# Altium project a311d.PrjPcb
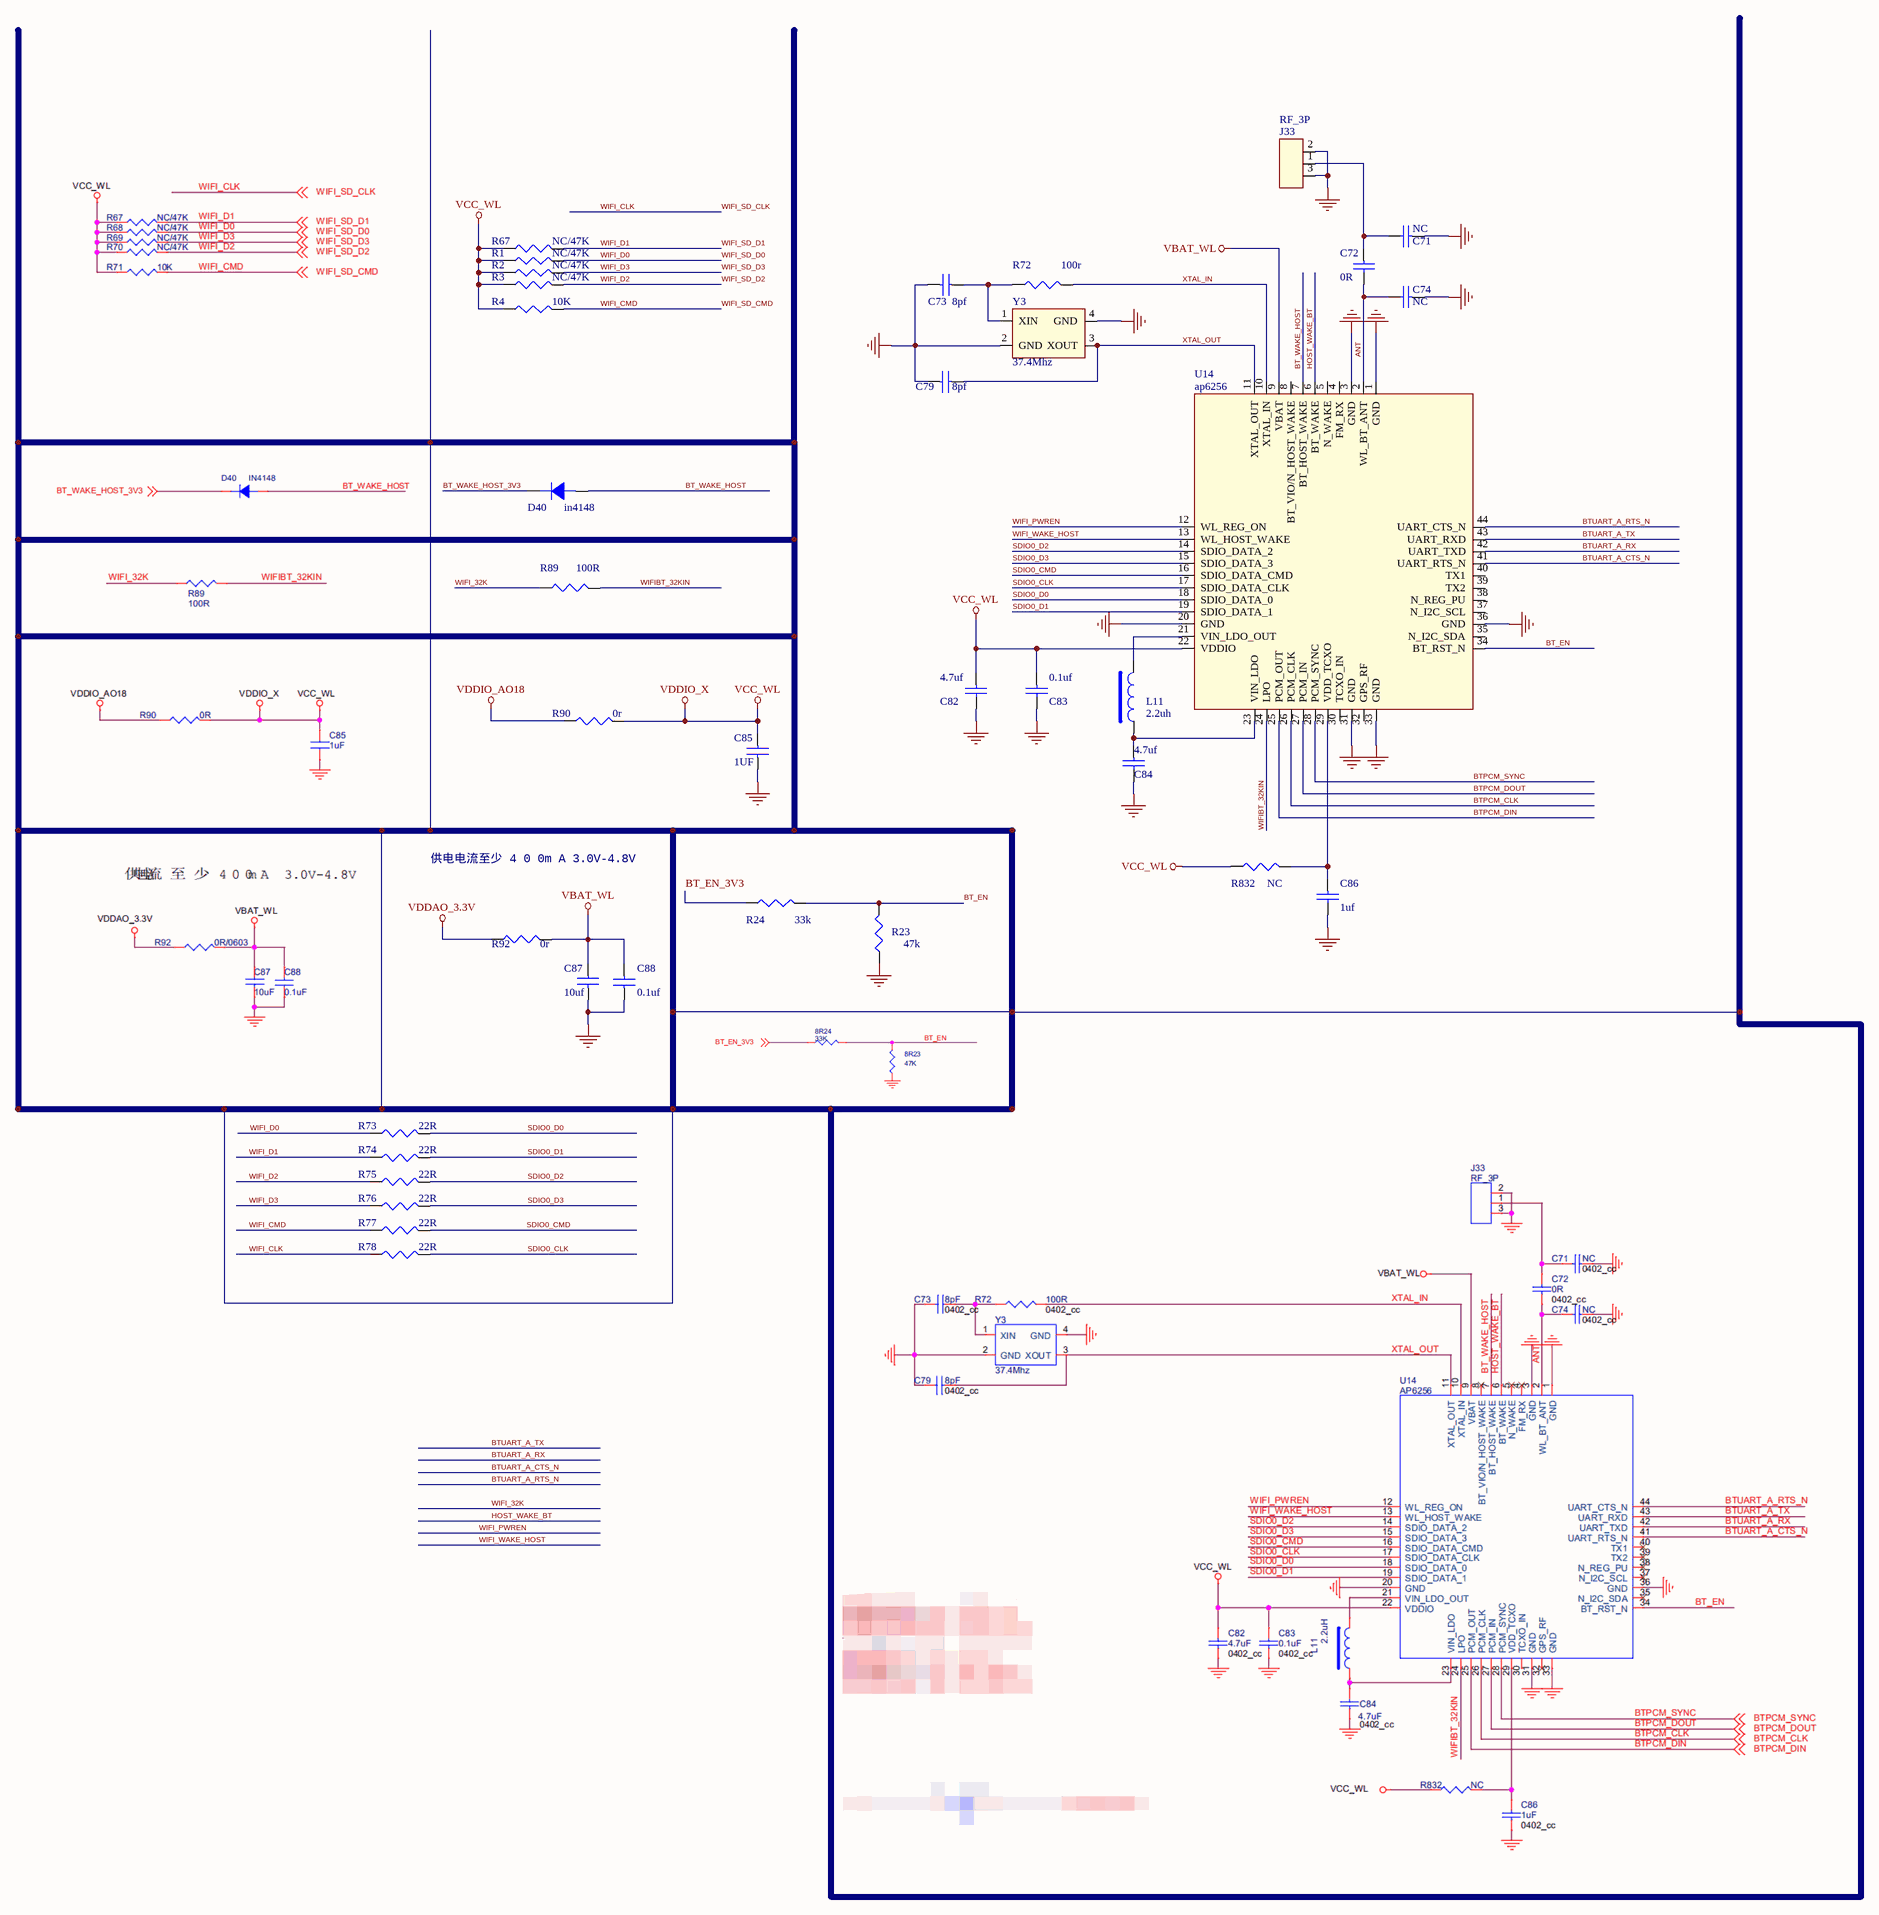
[diagram p0: wifi.SchDoc]
7 sheets, 219 parts. Net scope: global (net labels, ports and power ports of the same name join across sheets).
Board file: PCB2.PcbDoc
Sheets:
  wifi.SchDoc
  hdmi.SchDoc
  usb.SchDoc
  mipi_dsi.SchDoc
  tfcard.SchDoc
  SOC.SchDoc
  POWER.SchDoc

## Sheet wifi.SchDoc
size A2

### Parts
C71  NC
C72  0R
C73  8pf  [C0402]
C74  NC
C79  8pf  [C0402]
C82  4.7uf
C83  0.1uf
C84  4.7uf
C85  1UF  [C0402]
C86  1uf
C87  10uf  [C0402]
C88  0.1uf  [C0402]
D40  in4148
J33  RF_3P
L11  2.2uh
R1  NC/47K
R2  NC/47K
R3  NC/47K
R4  10K
R23  47k
R24  33k
R67  NC/47K
R72  100r  [R0402]
R73  22R
R74  22R
R75  22R
R76  22R
R77  22R
R78  22R
R89  100R
R90  0r
R92  0r
R832  NC
U14  ap6256
Y3  37.4Mhz  [CRY-3225]

### Nets
GND_IN: C71.2 C73.2 C74.2 C79.1 C82.1 C83.1 C84.1 C85.2 C86.1 C87.2 C88.1 J33.2 J33.3 R23.1 U14.1(GND) U14.3(GND) U14.20(GND) U14.31(GND) U14.33(GND) U14.36(GND) Y3.2(GND) Y3.4(GND)
VBAT_WL: C87.1 C88.2 R92.1 U14.9(VBAT)
VCC_WL: C82.2 C83.2 C85.1 R1.1 R2.1 R3.1 R4.1 R67.1 R90.1 R832.1 U14.22(VDDIO)  [also labelled VDDIO_X]
VDDAO_3.3V: R92.2
VDDIO_AO18: R90.2
ANT: C72.1 C74.1 U14.2(WL_BT_ANT)
BT_EN: R23.2 R24.2 U14.34(BT_RST_N)
BT_EN_3V3: R24.1
BT_WAKE_HOST: D40.1(A) U14.7(BT_HOST_WAKE)
BT_WAKE_HOST_3V3: D40.2(K)
BTPCM_CLK: U14.26(PCM_CLK)
BTPCM_DIN: U14.25(PCM_OUT)
BTPCM_DOUT: U14.27(PCM_IN)
BTPCM_SYNC: U14.28(PCM_SYNC)
BTUART_A_CTS_N: U14.41(UART_RTS_N)
BTUART_A_RTS_N: U14.44(UART_CTS_N)
BTUART_A_RX: U14.42(UART_TXD)
BTUART_A_TX: U14.43(UART_RXD)
HOST_WAKE_BT: U14.6(BT_WAKE)
SDIO0_CLK: R78.2 U14.17(SDIO_DATA_CLK)
SDIO0_CMD: R77.2 U14.16(SDIO_DATA_CMD)
SDIO0_D0: R73.2 U14.18(SDIO_DATA_0)
SDIO0_D1: R74.2 U14.19(SDIO_DATA_1)
SDIO0_D2: R75.2 U14.14(SDIO_DATA_2)
SDIO0_D3: R76.2 U14.15(SDIO_DATA_3)
WIFI_32K: R89.2
WIFI_CLK: R78.1  [also labelled WIFI_SD_CLK]
WIFI_CMD: R4.2 R77.1  [also labelled WIFI_SD_CMD]
WIFI_D0: R1.2 R73.1  [also labelled WIFI_SD_D0]
WIFI_D1: R67.2 R74.1  [also labelled WIFI_SD_D1]
WIFI_D2: R3.2 R75.1  [also labelled WIFI_SD_D2]
WIFI_D3: R2.2 R76.1  [also labelled WIFI_SD_D3]
WIFI_PWREN: U14.12(WL_REG_ON)
WIFI_WAKE_HOST: U14.13(WL_HOST_WAKE)
WIFIBT_32KIN: R89.1 U14.24(LPO)
XTAL_IN: R72.2 U14.10(XTAL_IN)
XTAL_OUT: C79.2 U14.11(XTAL_OUT) Y3.3(XOUT)
NetC71_1: C71.1 C72.2 J33.1
NetC73_1: C73.1 R72.1 Y3.1(XIN)
NetC84_2: C84.2 L11.1 U14.23(VIN_LDO)
NetC86_2: C86.2 R832.2 U14.29(VDD_TCXO)
NetL11_2: L11.2 U14.21(VIN_LDO_OUT)

Not connected (* = marked no-connect by the designer): U14 4(FM_RX) 5(N_WAKE) 8(BT_VIO/N_HOST_WAKE) 30(TCXO_IN) 32(GPS_RF) 35(N_I2C_SDA) 37(N_I2C_SCL) 38(N_REG_PU) 39(TX2) 40(TX1)

### Notes on the sheet
- 供电电流至少 4 0 0m A 3.0V-4.8V

### Library data of the parts
C71 C72 C74 C82-C84 C86 = CAPNP_Dup1_1
C73 C79 C85 C87 C88 = CAP NP
D40 = DIODE: J102: U4
J33 = CON3_1
L11 = INDUCTOR_1
R1-R4 R23 R24 R67 R73-R78 R89 R832 = RESISTOR
R72 = R_0
R90 R92 = RESISTOR_1
U14 = AP6493_1
Y3 = CRYSTAL-4_4: ass

## Sheet hdmi.SchDoc
size 720 x 297 mm
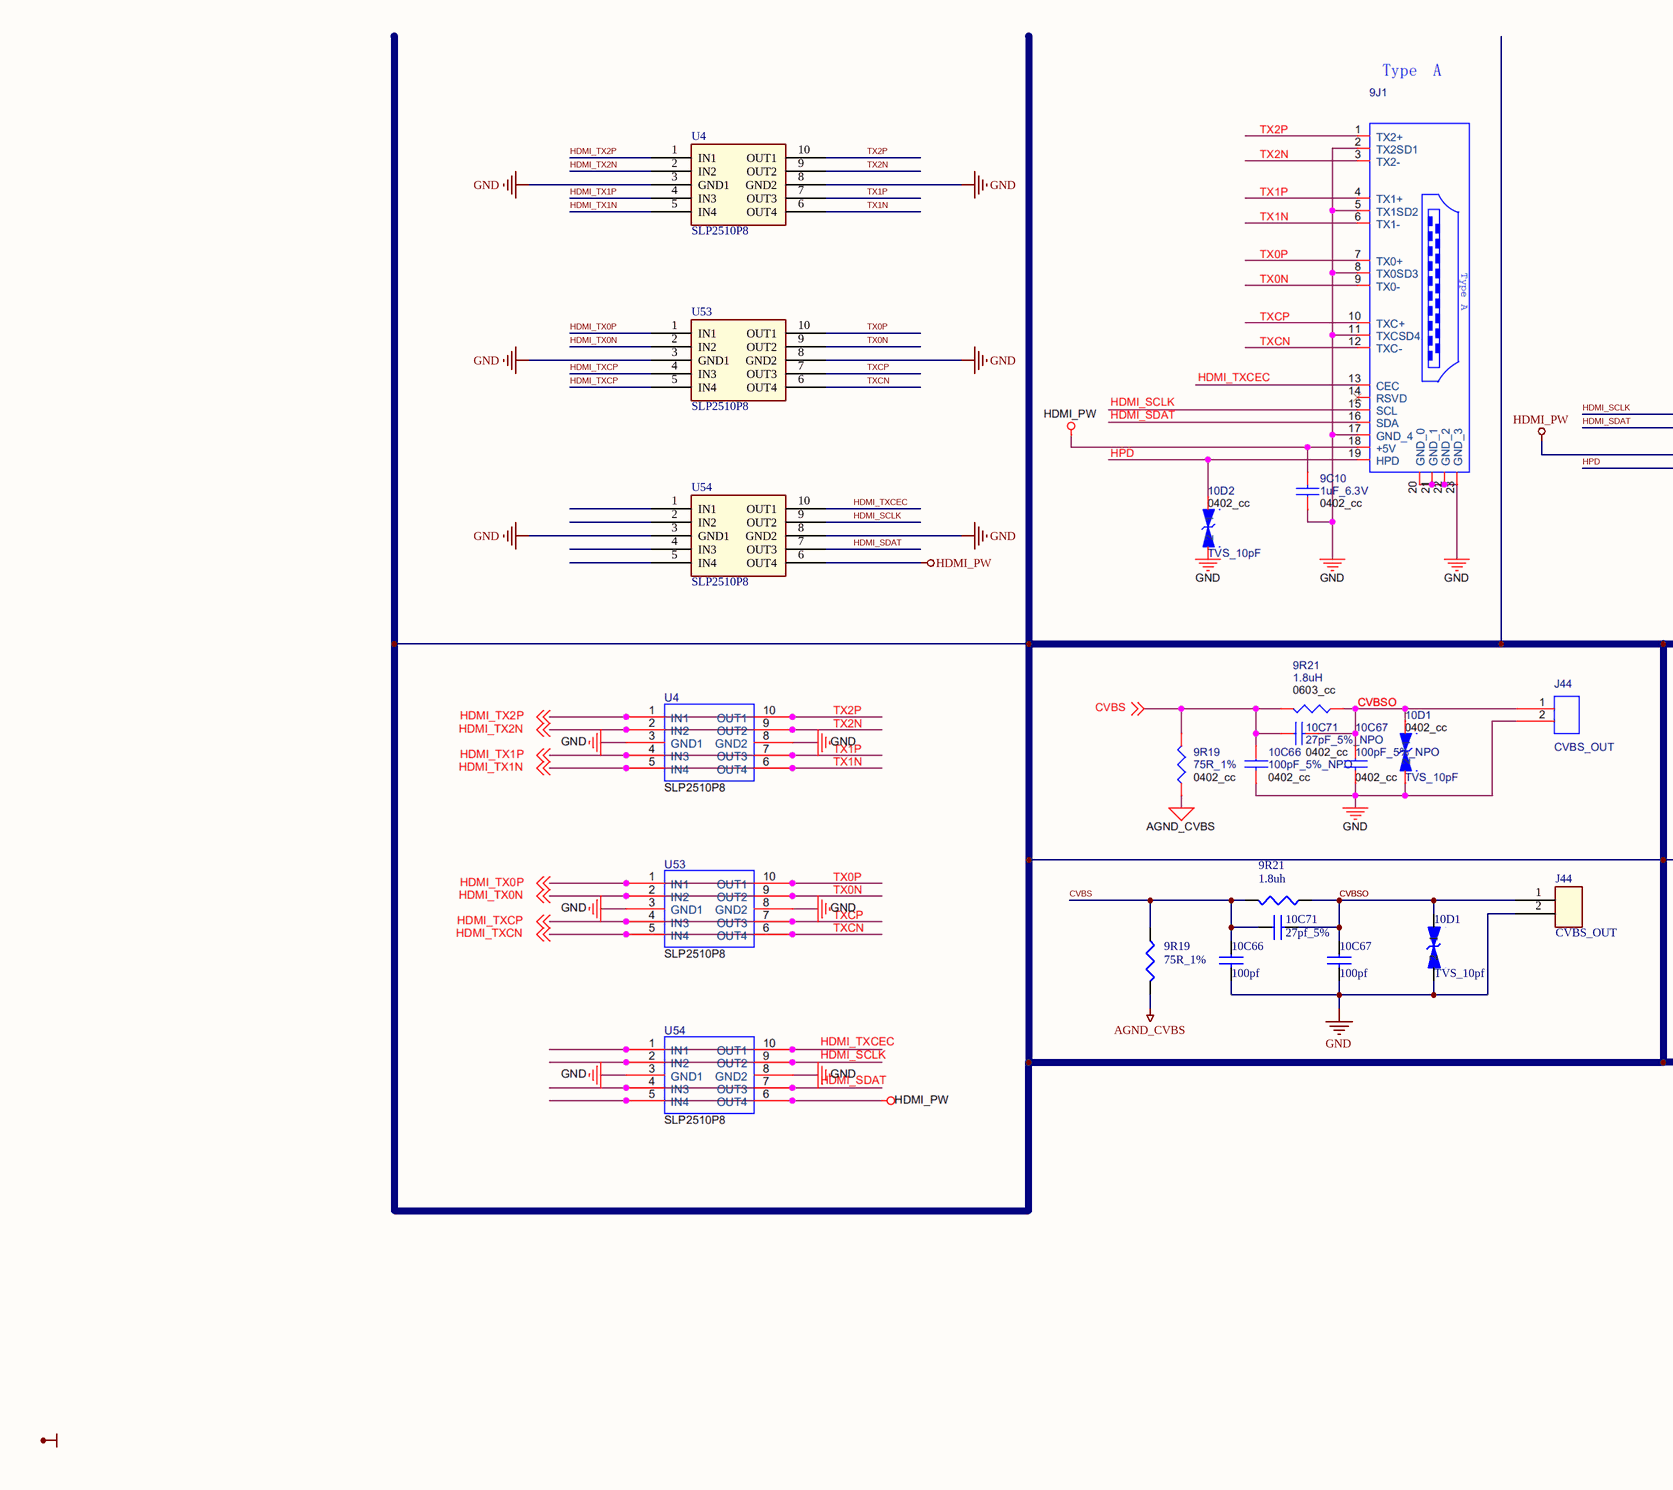
[diagram p1: hdmi.SchDoc, left]
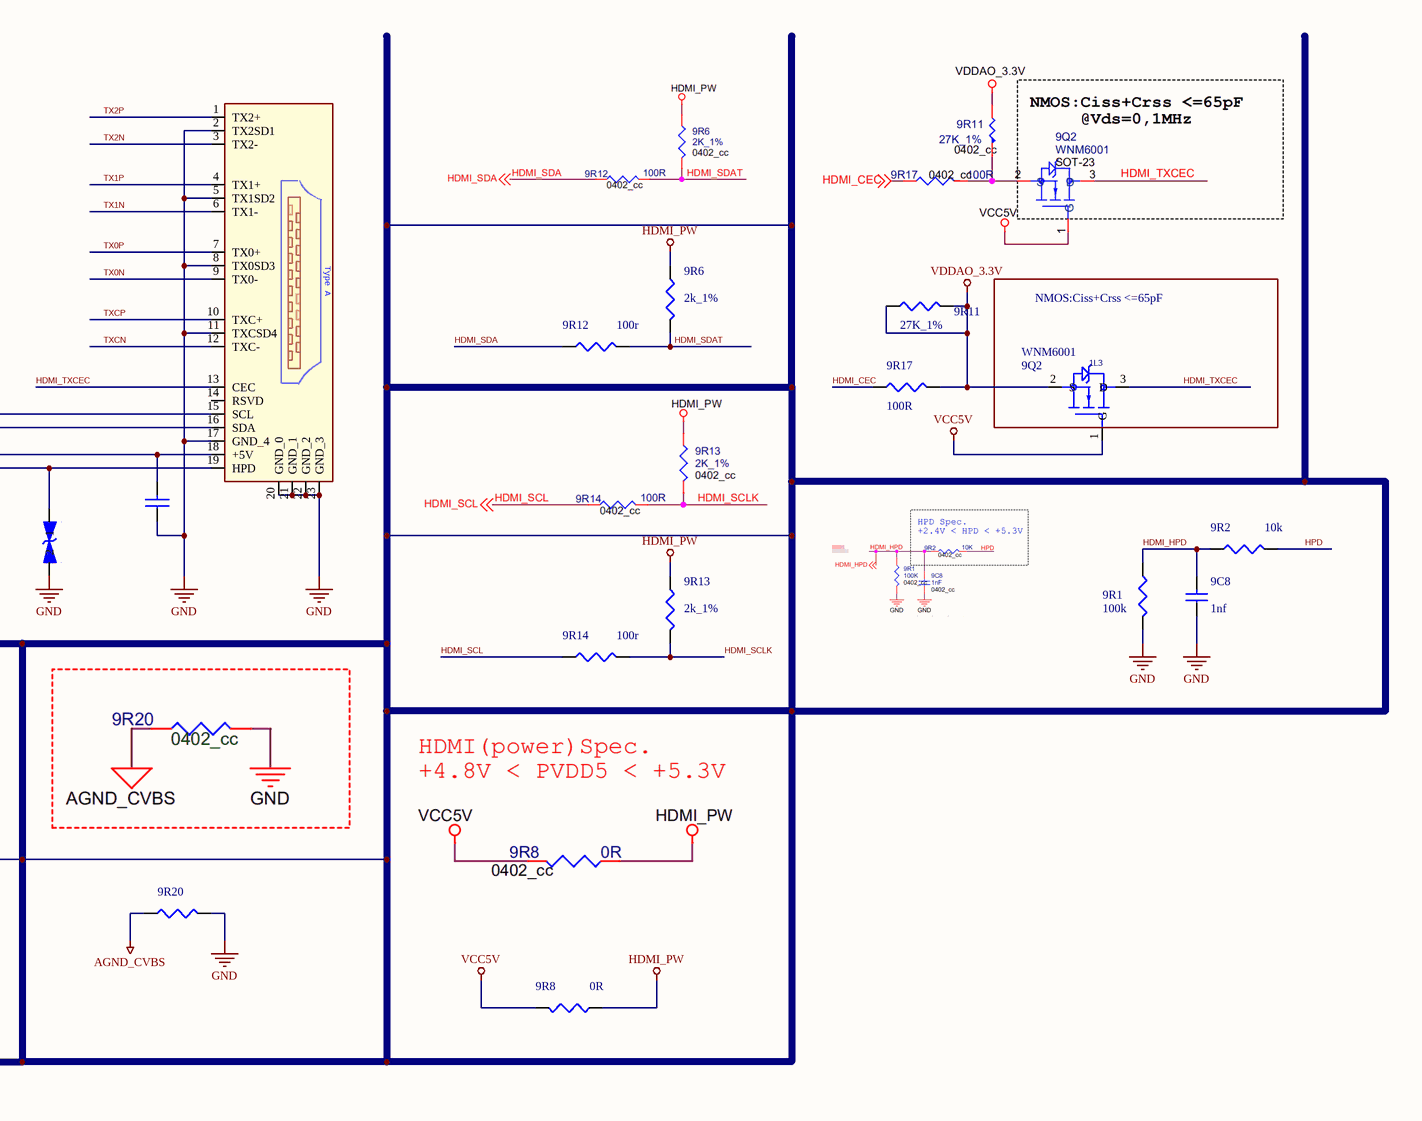
[diagram p2: hdmi.SchDoc, right]

### Parts
9C8  1nf  [0603C]
9C10  (no value)
9J1  (no value)
9Q2  WNM6001  J102: 1L3
9R1  100k
9R2  10k
9R6  2k_1%
9R8  0R
9R11  27K_1%
9R12  100r
9R13  2k_1%
9R14  100r
9R17  100R
9R19  75R_1%
9R20  (no value)
9R21  1.8uh
10C66  100pf
10C67  100pf
10C71  27pf_5%
10D1  TVS_10pf
10D2  (no value)
J44  CVBS_OUT
U4  SLP2510P8
U53  SLP2510P8
U54  SLP2510P8

### Blocks framed on the sheet
NMOS:Ciss+Crss <=65pF: 9Q2

### Nets
AGND_CVBS: 9R19.2 9R20.1
GND: 9C8.1 9C10.1 9J1.2(TX2SD1) 9J1.5(TX1SD2) 9J1.8(TX0SD3) 9J1.11(TXCSD4) 9J1.17(GND_4) 9J1.20(GND_0) 9J1.21(GND_1) 9J1.22(GND_2) 9J1.23(GND_3) 9R1.2 9R20.2 10C66.2 10C67.2 10D1.2 10D2.2 J44.2 U4.3(GND1) U4.8(GND2) U53.3(GND1) U53.8(GND2) U54.3(GND1) U54.8(GND2)
HDMI_PW: 9C10.2 9J1.18(+5V) 9R6.1 9R8.1 9R13.1 U54.6(OUT4)
VCC5V: 9Q2.1(G) 9R8.2
VDDAO_3.3V: 9Q2.2(S) 9R11.1 9R11.2 9R17.1
CVBS: 9R19.1 9R21.2 10C66.1 10C71.1
CVBSO: 9R21.1 10C67.1 10C71.2 10D1.1 J44.1
HDMI_CEC: 9R17.2
HDMI_HPD: 9C8.2 9R1.1 9R2.1
HDMI_SCL: 9R14.1
HDMI_SCLK: 9J1.15(SCL) 9R13.2 9R14.2 U54.9(OUT2)
HDMI_SDA: 9R12.1
HDMI_SDAT: 9J1.16(SDA) 9R6.2 9R12.2 U54.7(OUT3)
HDMI_TX0N: U53.2(IN2)
HDMI_TX0P: U53.1(IN1)
HDMI_TX1N: U4.5(IN4)
HDMI_TX1P: U4.4(IN3)
HDMI_TX2N: U4.2(IN2)
HDMI_TX2P: U4.1(IN1)
HDMI_TXCEC: 9J1.13(CEC) 9Q2.3(D) U54.10(OUT1)
HDMI_TXCP: U53.4(IN3) U53.5(IN4)
HPD: 9J1.19(HPD) 9R2.2 10D2.1
TX0N: 9J1.9(TX0-) U53.9(OUT2)
TX0P: 9J1.7(TX0+) U53.10(OUT1)
TX1N: 9J1.6(TX1-) U4.6(OUT4)
TX1P: 9J1.4(TX1+) U4.7(OUT3)
TX2N: 9J1.3(TX2-) U4.9(OUT2)
TX2P: 9J1.1(TX2+) U4.10(OUT1)
TXCN: 9J1.12(TXC-) U53.6(OUT4)
TXCP: 9J1.10(TXC+) U53.7(OUT3)

Not connected (* = marked no-connect by the designer): 9J1 14(RSVD); U54 1(IN1) 2(IN2) 4(IN3) 5(IN4)

### Notes on the sheet
- (in symbol J-HDMI-TYPE-A-19P_1) Type A

### Library data of the parts
9C8 = capnp
9C10 10C66 10C67 10C71 = CAP NP_6
9J1 = J-HDMI-TYPE-A-19P_1
9Q2 = Mosfetp_4: SOT-23; 1R42: Q1
9R1 9R2 9R6 9R8 9R12-9R14 9R20 = RESISTOR
9R11 9R17 = R
9R19 9R21 = RESISTOR_3
10D1 10D2 = TVS DIODE
J44 = CON2
U4 U53 U54 = rRClamp0524P

## Sheet usb.SchDoc
size A2
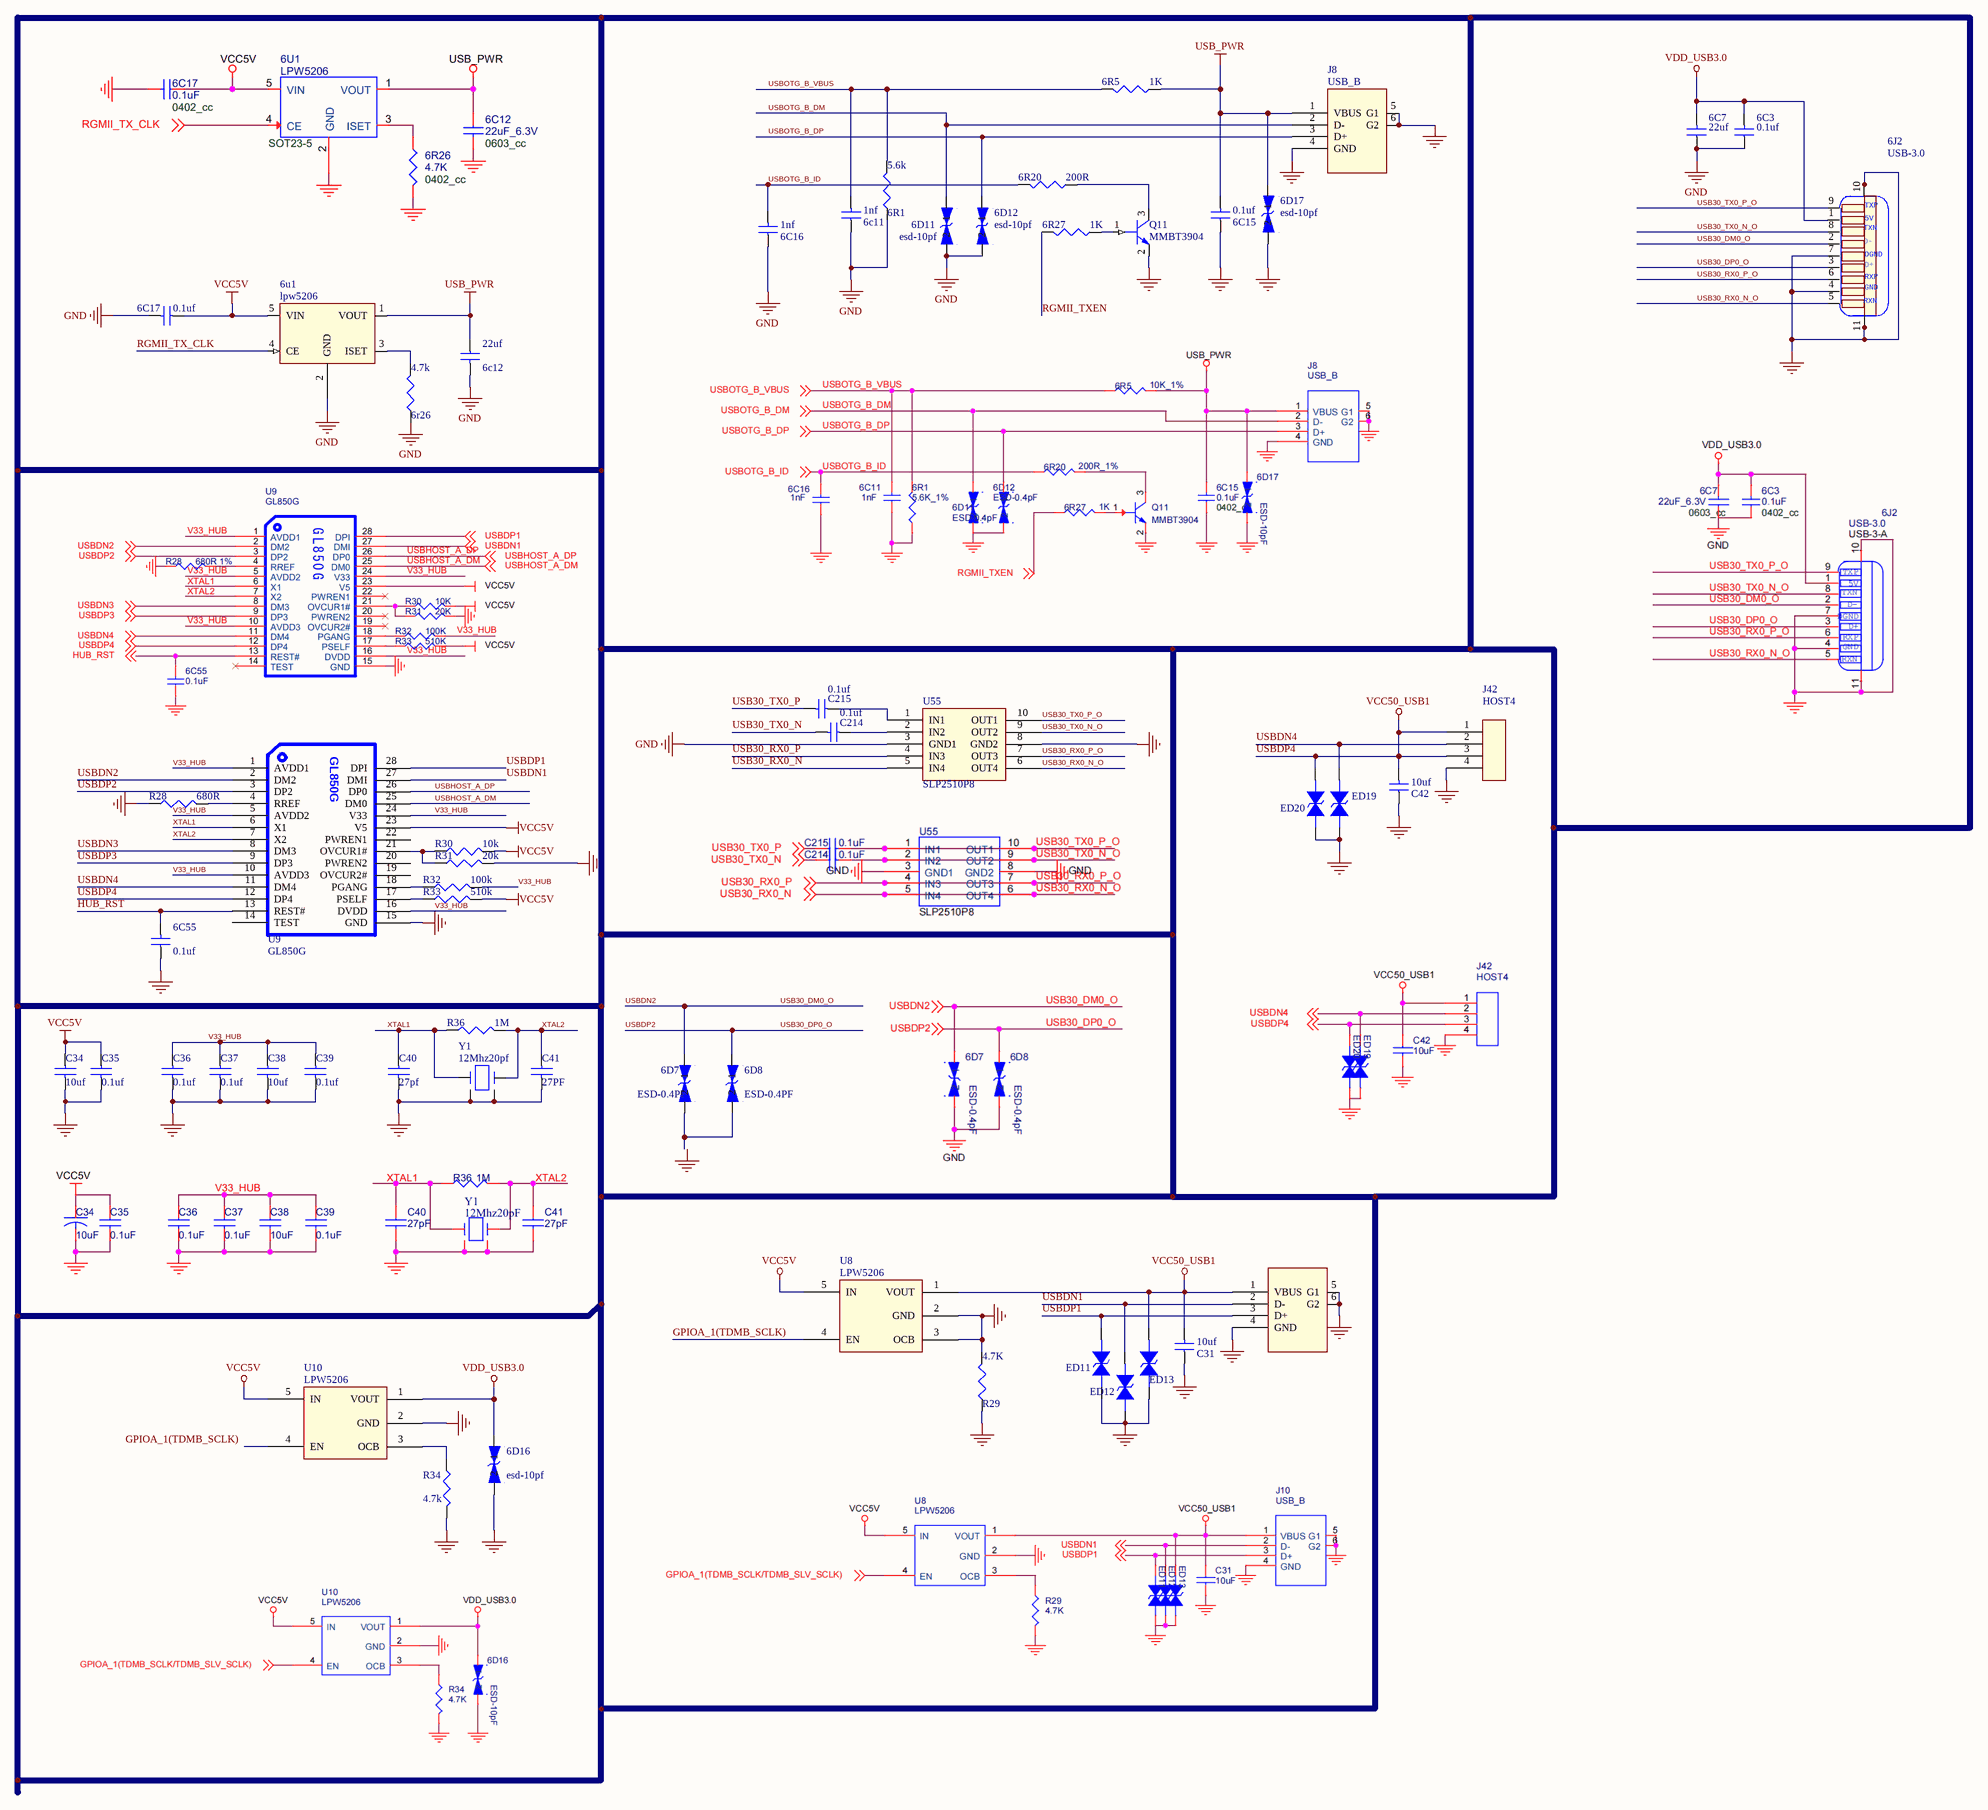
[diagram p3: usb.SchDoc]

### Parts
6C3  0.1uf  [0603C]
6C7  22uf  [0603C]
6c11  1nf  [0603C]
6c12  22uf  [0603C]
6C15  0.1uf  [0603C]
6C16  1nf  [0603C]
6C17  0.1uf  [0603C]
6C55  0.1uf  [0603C]
6D7  ESD-0.4PF
6D8  ESD-0.4PF
6D11  esd-10pf
6D12  esd-10pf
6D16  esd-10pf
6D17  esd-10pf
6J2  USB-3.0
6R1  5.6k  [R0603]
6R5  1K  [R0603]
6R20  200R  [R0603]
6r26  4.7k  [R0603]
6R27  1K  [R0603]
6u1  lpw5206  [SOT-25]
C31  10uf  [0603C]
C34  10uf
C35  0.1uf
C36  0.1uf
C37  0.1uf
C38  10uf
C39  0.1uf
C40  27pf
C41  27PF
C42  10uf  [0603C]
C214  0.1uf  [0603C]
C215  0.1uf  [0603C]
ED11  (no value)
ED12  (no value)
ED13  (no value)
ED19  (no value)
ED20  (no value)
J4  (no value)
J8  USB_B
J42  HOST4
Q11  MMBT3904
R28  680R  [R0603]
R29  4.7K  [R0603]
R30  10k  [R0603]
R31  20k  [R0603]
R32  100k  [R0603]
R33  510k  [R0603]
R34  4.7k  [R0402]
R36  1M  [R0603]
U8  LPW5206
U9  GL850G
U10  LPW5206
U55  SLP2510P8
Y1  12Mhz20pf

### Nets
GND: 6C3.1 6C7.1 6c11.1 6c12.2 6C16.1 6C17.2 6D11.2 6D12.2 6R1.1 6r26.1 6u1.2(GND) U55.3(GND1)
GND_IN: 6C15.1 6C55.1 6D16.2 6D17.2 6J2.4(GND) 6J2.7(DGND) 6J2.10(S1) 6J2.11(S2) C31.1 C34.2 C35.2 C36.2 C37.2 C38.2 C39.2 C40.2 C41.2 C42.1 ED11.2 ED12.2 ED13.2 ED19.2 ED20.2 J4.4(GND) J4.5(G1) J4.6(G2) J8.4(GND) J8.5(G1) J8.6(G2) J42.4 Q11.2(EMITTER) R28.1 R29.1 R29.2 R31.2 R34.2 U8.2(GND) U8.3(OCB) U9.15(GND) U10.2(GND) U55.8(GND2) Y1.2 Y1.4
USB_PWR: 6c12.1 6C15.2 6D17.1 6R5.1 6u1.1(VOUT) J8.1(VBUS)
USBDP4: C31.2 C42.2 ED13.1 ED20.1 J4.1(VBUS) J42.1 J42.3 U8.1(VOUT) U9.12(DP4)  [also labelled VCC50_USB1]
VCC5V: 6C17.1 6u1.5(VIN) C34.1 C35.1 R30.2 R33.2 U8.5(IN) U9.23(V5) U10.5(IN)
VDD_USB3.0: 6C3.2 6C7.2 6D16.1 6J2.1(VBUS) U10.1(VOUT)
GPIOA_1(TDMB_SCLK): U8.4(EN)
HUB_RST: 6C55.2 U9.13(REST#)
RGMII_TX_CLK: 6u1.4(CE)
RGMII_TXEN: 6R27.2
USB30_DM0_O: 6D7.1 6J2.2(D-) U9.2(DM2)  [also labelled USBDN2]
USB30_DP0_O: 6D8.1 6J2.3(D+) U9.3(DP2)  [also labelled USBDP2]
USB30_RX0_N: U55.5(IN4)
USB30_RX0_N_O: 6J2.5(RXN) U55.6(OUT4)
USB30_RX0_P: U55.4(IN3)
USB30_RX0_P_O: 6J2.6(RXP) U55.7(OUT3)
USB30_TX0_N: C214.2
USB30_TX0_N_O: 6J2.8(TXN) U55.9(OUT2)
USB30_TX0_P: C215.2
USB30_TX0_P_O: 6J2.9(TXP) U55.10(OUT1)
USBDN1: ED12.1 J4.2(D-) U9.27(DMI)
USBDN3: U9.8(DM3)
USBDN4: ED19.1 J42.2 U9.11(DM4)
USBDP1: ED11.1 J4.3(D+) U9.28(DPI)
USBDP3: U9.9(DP3)
USBHOST_A_DM: U9.25(DM0)
USBHOST_A_DP: U9.26(DP0)
USBOTG_B_DM: 6D11.1 J8.2(D-)
USBOTG_B_DP: 6D12.1 J8.3(D+)
USBOTG_B_ID: 6C16.2 6R20.2
USBOTG_B_VBUS: 6c11.2 6R1.2 6R5.2
V33_HUB: C36.1 C37.1 C38.1 C39.1 R32.2 U9.1(AVDD1) U9.5(AVDD2) U9.10(AVDD3) U9.16(DVDD) U9.24(V33)
XTAL1: C40.1 R36.1 U9.6(X1) Y1.1
XTAL2: C41.1 R36.2 U9.7(X2) Y1.3
Net6D7_2: 6D7.2 6D8.2
Net6R20_1: 6R20.1 Q11.3(COLLECT)
Net6r26_2: 6r26.2 6u1.3(ISET)
Net6R27_1: 6R27.1 Q11.1(BASE)
NetC214_1: C214.1 U55.2(IN2)
NetC215_1: C215.1 U55.1(IN1)
NetR28_2: R28.2 U9.4(RREF)
NetR30_1: R30.1 R31.1 U9.21(OVCUR1#)
NetR32_1: R32.1 U9.18(PGANG)
NetR33_1: R33.1 U9.17(PSELF)
NetR34_1: R34.1 U10.3(OCB)

Not connected (* = marked no-connect by the designer): U9 14(TEST) 19(OVCUR2#) 20(PWREN2) 22(PWREN1); U10 4(EN)

### Notes on the sheet
- Labels drawn without touching a wire or pin: GPIOA_1(TDMB_SCLK)
- (in symbol USB_0) 5V

### Library data of the parts
6C3 6C7 6c11 6c12 6C15-6C17 6C55 C31 C42 C214 C215 = capnp: 1R42: 8R12
6D7 6D8 6D11 6D12 6D16 6D17 = TVS DIODE
6J2 = USB_0
6R1 6R5 6R20 6r26 6R27 R28-R33 R36 = 01RES
6u1 = U_RT9701_2
C34-C41 = CAP
ED11-ED13 ED19 ED20 = DIODE BI-DIR TRIG
J4 J8 = USB_A_1
J42 = CON4
Q11 = NPN_1: J102: 1L3
R34 = RESISTOR_2
U8 U10 = SWITCH_SY6280
U9 = gl850_0
U55 = rRClamp0524P
Y1 = CRYSTAL_2

## Sheet mipi_dsi.SchDoc
size A2
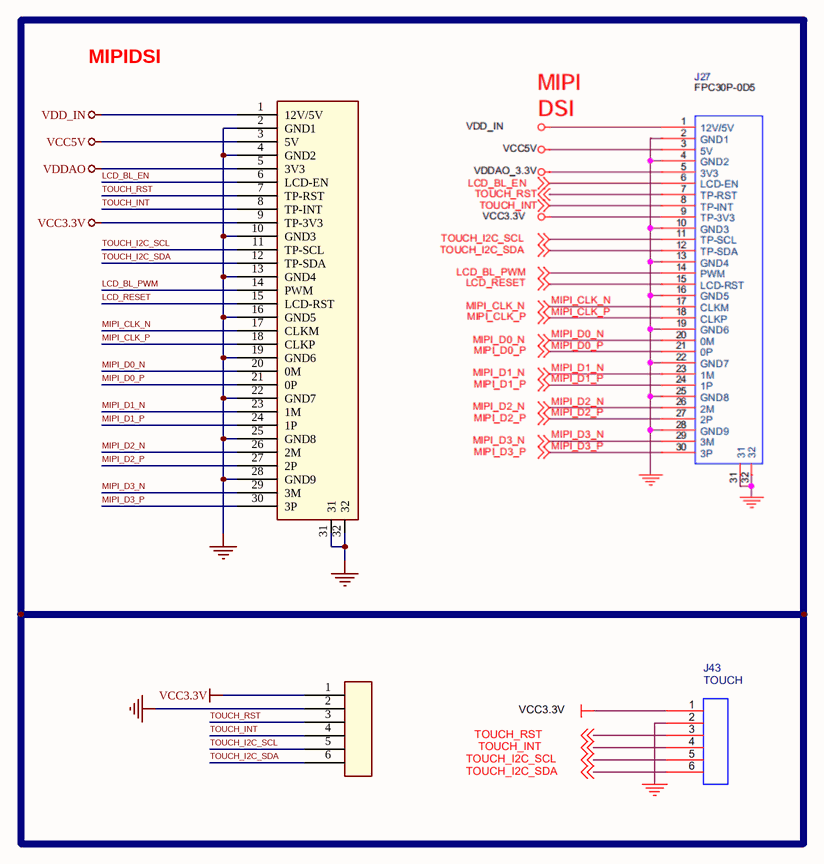
[diagram p4: mipi_dsi.SchDoc]

### Parts
J5  (no value)
J6  (no value)

### Nets
GND_IN: J5.2(GND1) J5.4(GND2) J5.10(GND3) J5.13(GND4) J5.16(GND5) J5.19(GND6) J5.22(GND7) J5.25(GND8) J5.28(GND9) J5.31 J5.32 J6.2
VCC3.3V: J5.9(TP-3V3) J6.1
VCC5V: J5.3(5V)
VDD_IN: J5.1(12V/5V)  [project net 4.5~18V]
VDDAO: J5.5(3V3)
LCD_BL_EN: J5.6(LCD-EN)
LCD_BL_PWM: J5.14(PWM)
LCD_RESET: J5.15(LCD-RST)
MIPI_CLK_N: J5.17(CLKM)
MIPI_CLK_P: J5.18(CLKP)
MIPI_D0_N: J5.20(0M)
MIPI_D0_P: J5.21(0P)
MIPI_D1_N: J5.23(1M)
MIPI_D1_P: J5.24(1P)
MIPI_D2_N: J5.26(2M)
MIPI_D2_P: J5.27(2P)
MIPI_D3_N: J5.29(3M)
MIPI_D3_P: J5.30(3P)
TOUCH_I2C_SCL: J5.11(TP-SCL) J6.5
TOUCH_I2C_SDA: J5.12(TP-SDA) J6.6
TOUCH_INT: J5.8(TP-INT) J6.4
TOUCH_RST: J5.7(TP-RST) J6.3

### Notes on the sheet
- MIPIDSI

### Library data of the parts
J5 = FPC30_0
J6 = CON6

## Sheet tfcard.SchDoc
size A2
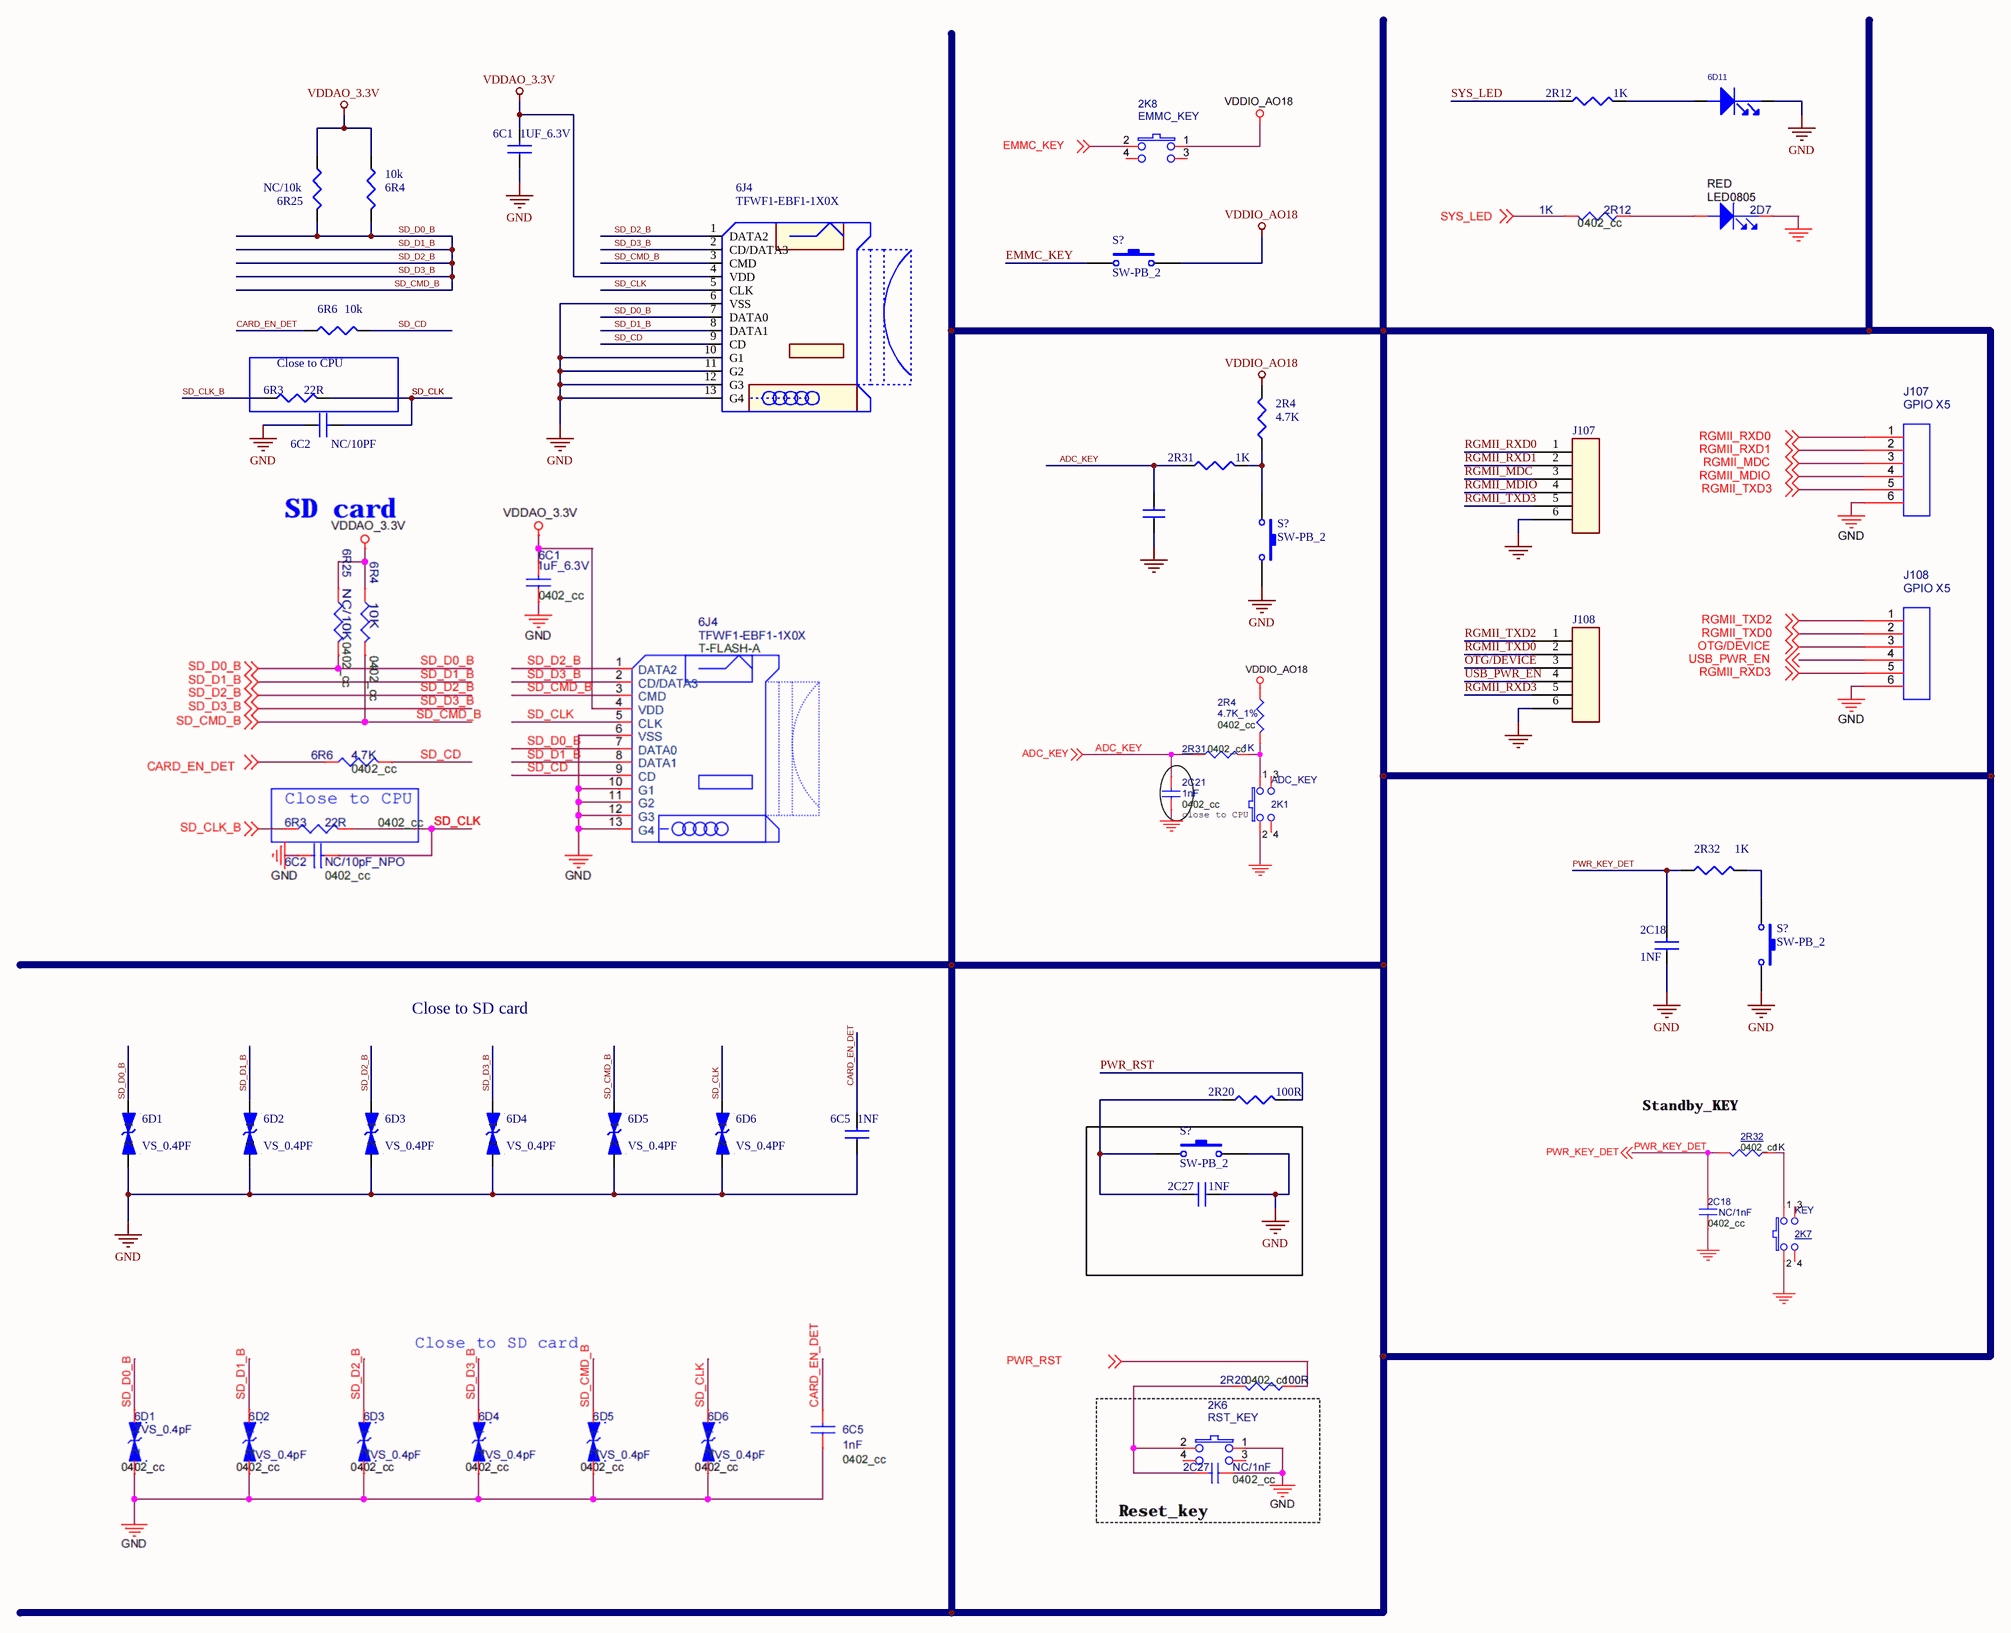
[diagram p5: tfcard.SchDoc]

### Parts
(Parts that share a designator on the sheet are numbered #1, #2 ... from top to bottom, then left to right.)
2C18  1NF
2C27  1NF
2R4  4.7K
2R12  1K
2R20  100R
2R31  1K
2R32  1K
6C1  1UF_6.3V
6C2  NC/10PF
6C5  1NF
6D1  VS_0.4PF
6D2  VS_0.4PF
6D3  VS_0.4PF
6D4  VS_0.4PF
6D5  VS_0.4PF
6D6  VS_0.4PF
6J4  TFWF1-EBF1-1X0X
6R3  22R
6R4  10k
6R6  10k
6R25  NC/10k
50  (no value)  [button]
51  (no value)  [button]
58  J102: 6D11
59  (no value)  [button]
61  (no value)  [button]
65  (no value)  [0603C]
J107  (no value)
J108  (no value)
S?#1  SW-PB_2  [SPST-2]
S?#2  SW-PB_2  [SPST-2]
S?#3  SW-PB_2  [SPST-2]
S?#4  SW-PB_2  [SPST-2]

### Blocks framed on the sheet
Close to CPU: 6R3

### Nets
GND: 2C18.1 2C27.1 6C1.1 6C2.1 6C5.1 6D1.2 6D2.2 6D3.2 6D4.2 6D5.2 6D6.2 6J4.6(VSS) 6J4.10(G1) 6J4.11(G2) 6J4.12(G3) 6J4.13(G4) 58.2 S?#2.2 S?#3.2 S?#4.2
GND_IN: 65.1 J107.6 J108.6
VDDAO_3.3V: 6C1.2 6J4.4(VDD) 6R4.1 6R25.1
VDDIO_AO18: 2R4.2 S?#1.2
ADC_KEY: 2R31.1 65.2
CARD_EN_DET: 6C5.2 6R6.1
EMMC_KEY: S?#1.1
OTG/DEVICE: J108.3
PWR_KEY_DET: 2C18.2 2R32.1
PWR_RST: 2R20.2
RGMII_MDC: J107.3
RGMII_MDIO: J107.4
RGMII_RXD0: J107.1
RGMII_RXD1: J107.2
RGMII_RXD3: J108.5
RGMII_TXD0: J108.2
RGMII_TXD2: J108.1
RGMII_TXD3: J107.5
SD_CD: 6J4.9(CD) 6R6.2
SD_CLK: 6C2.2 6D6.1 6J4.5(CLK) 6R3.2
SD_CLK_B: 6R3.1
SD_CMD_B: 6D1.1 6D2.1 6D3.1 6D4.1 6D5.1 6J4.1(DATA2) 6J4.2(CD/DATA3) 6J4.3(CMD) 6J4.7(DATA0) 6J4.8(DATA1) 6R4.2 6R25.2  [also labelled SD_D0_B, SD_D1_B, SD_D2_B, SD_D3_B]
SYS_LED: 2R12.1
USB_PWR_EN: J108.4
Net2C27_2: 2C27.2 2R20.1 S?#4.1
Net2R4_1: 2R4.1 2R31.2 S?#2.1
Net2R12_2: 2R12.2 58.1
Net2R32_2: 2R32.2 S?#3.1

### Notes on the sheet
- Close to SD card

### Library data of the parts
2C18 2C27 6C1 6C2 6C5 = CAP NP_6
2R4 2R12 2R20 2R31 2R32 6R3 6R4 6R6 6R25 = R
6D1-6D6 = TVS DIODE
6J4 = J-TF-CARD-PUSH
50 51 59 61 = BUTTON_0
58 = LED_3
65 = capnp: 1R42: 8R12
J107 J108 = CON6
S?#1-S?#4 = SW-PB_2: Switch; Published: 24-Mar-1999; LatestRevisionDate: 17-Jul-2002; LatestRevisionNote: Re-released for DXP Platform.; PackageReference: SPST-2; Publisher: Altium Limited; PackageDescription: Switch; 2 Leads

## Sheet SOC.SchDoc
size A1
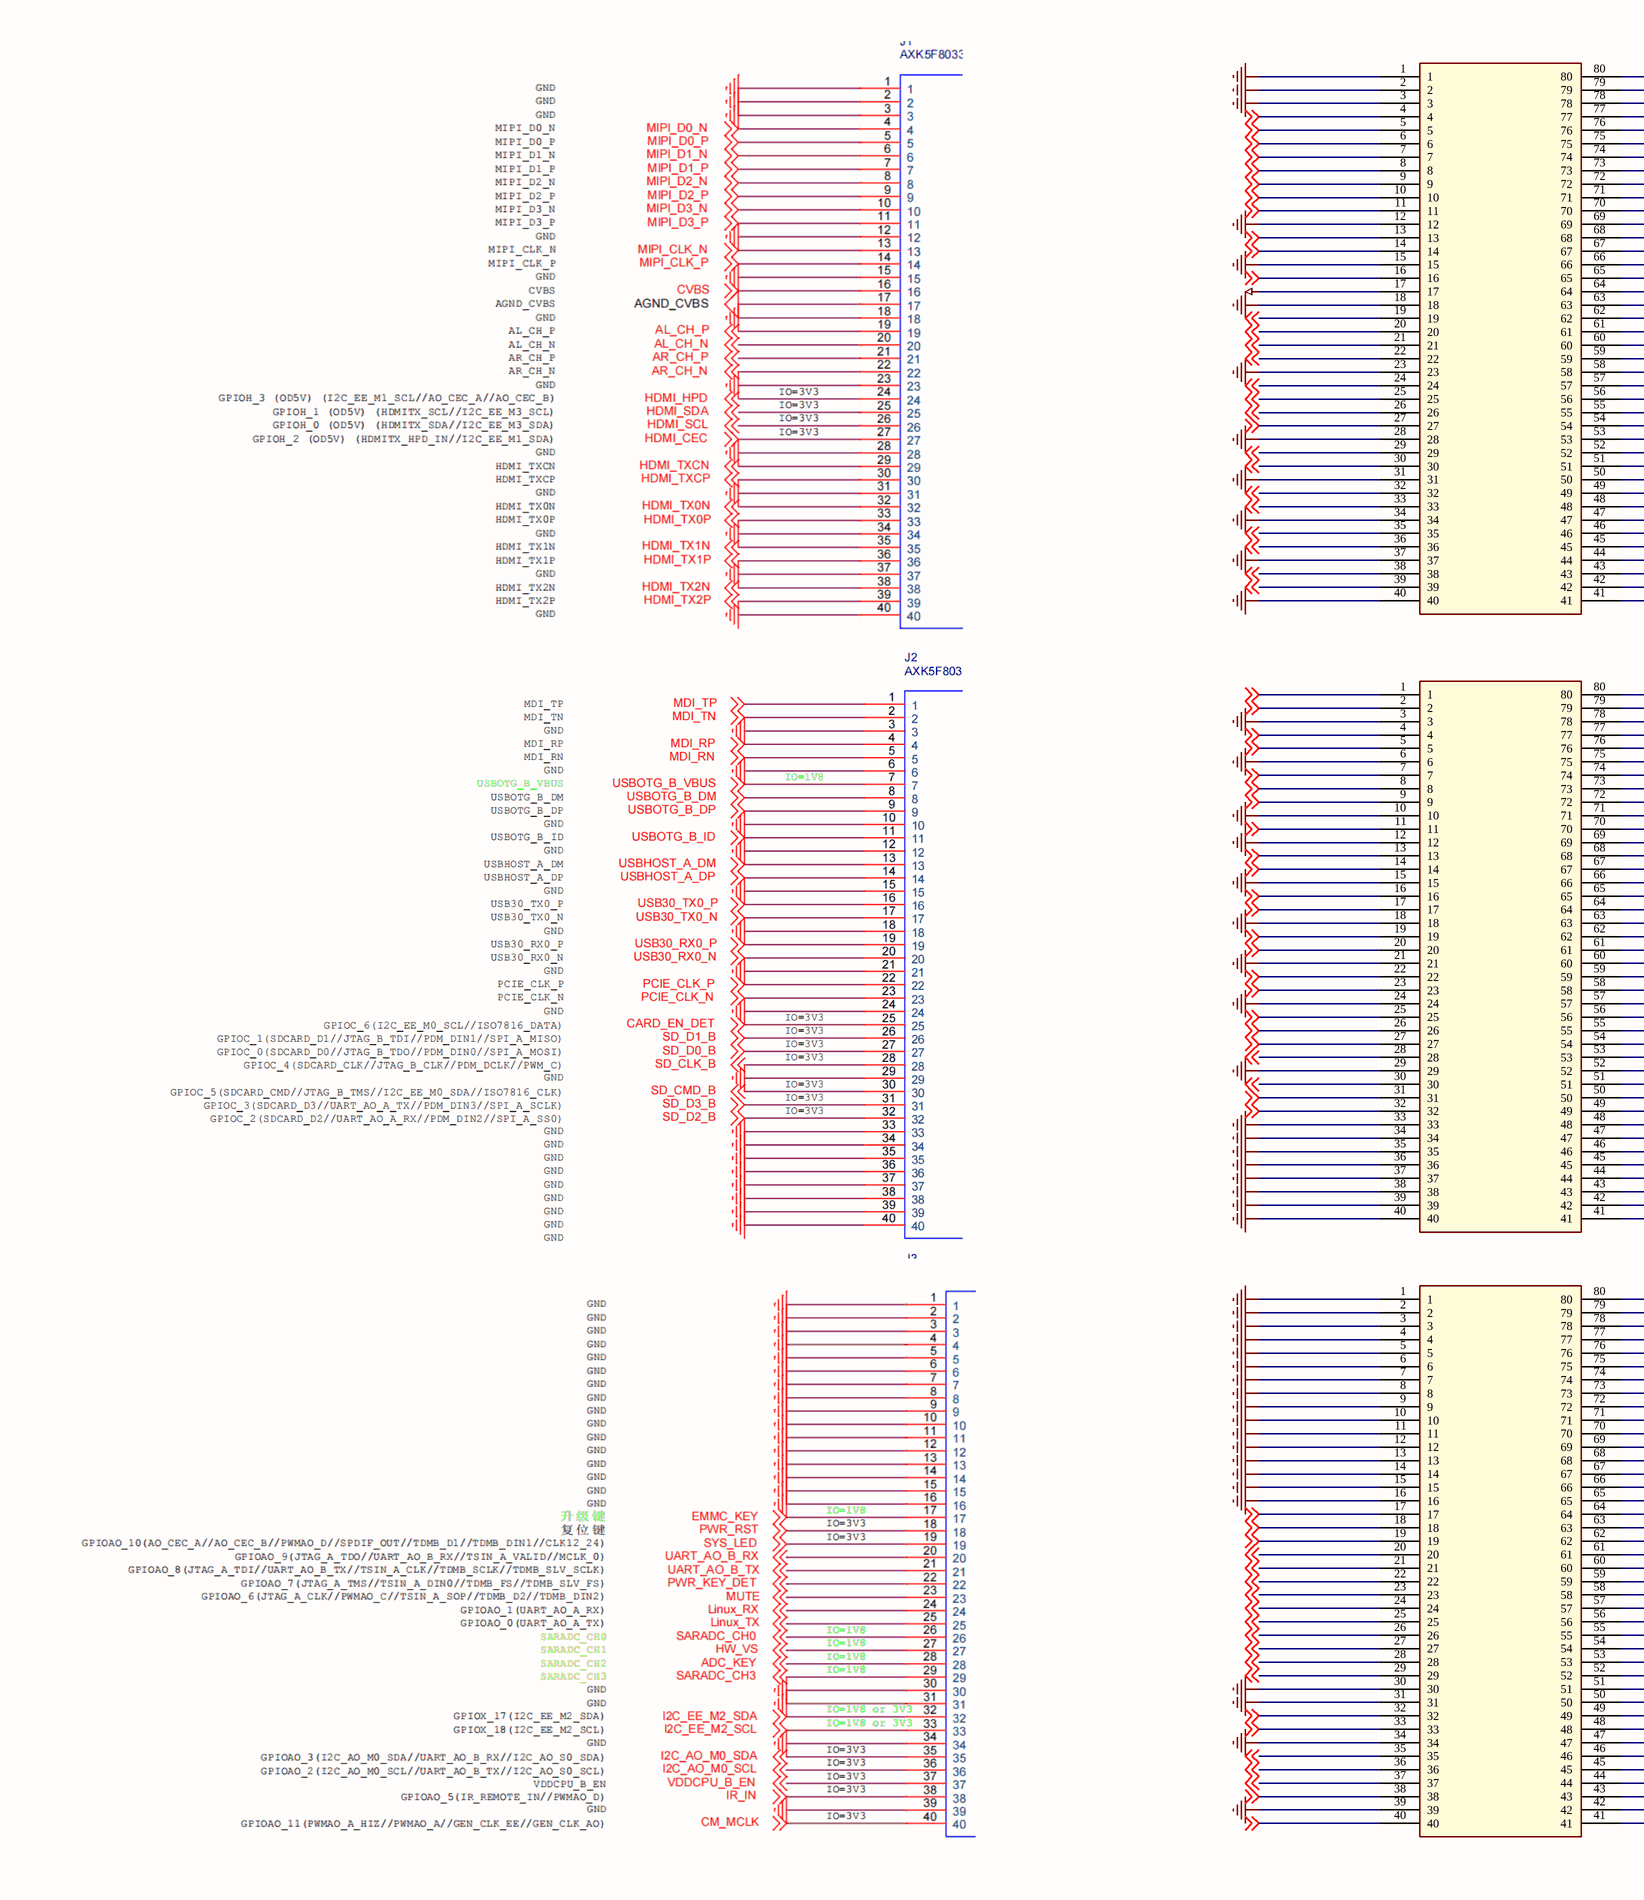
[diagram p6: SOC.SchDoc, left]
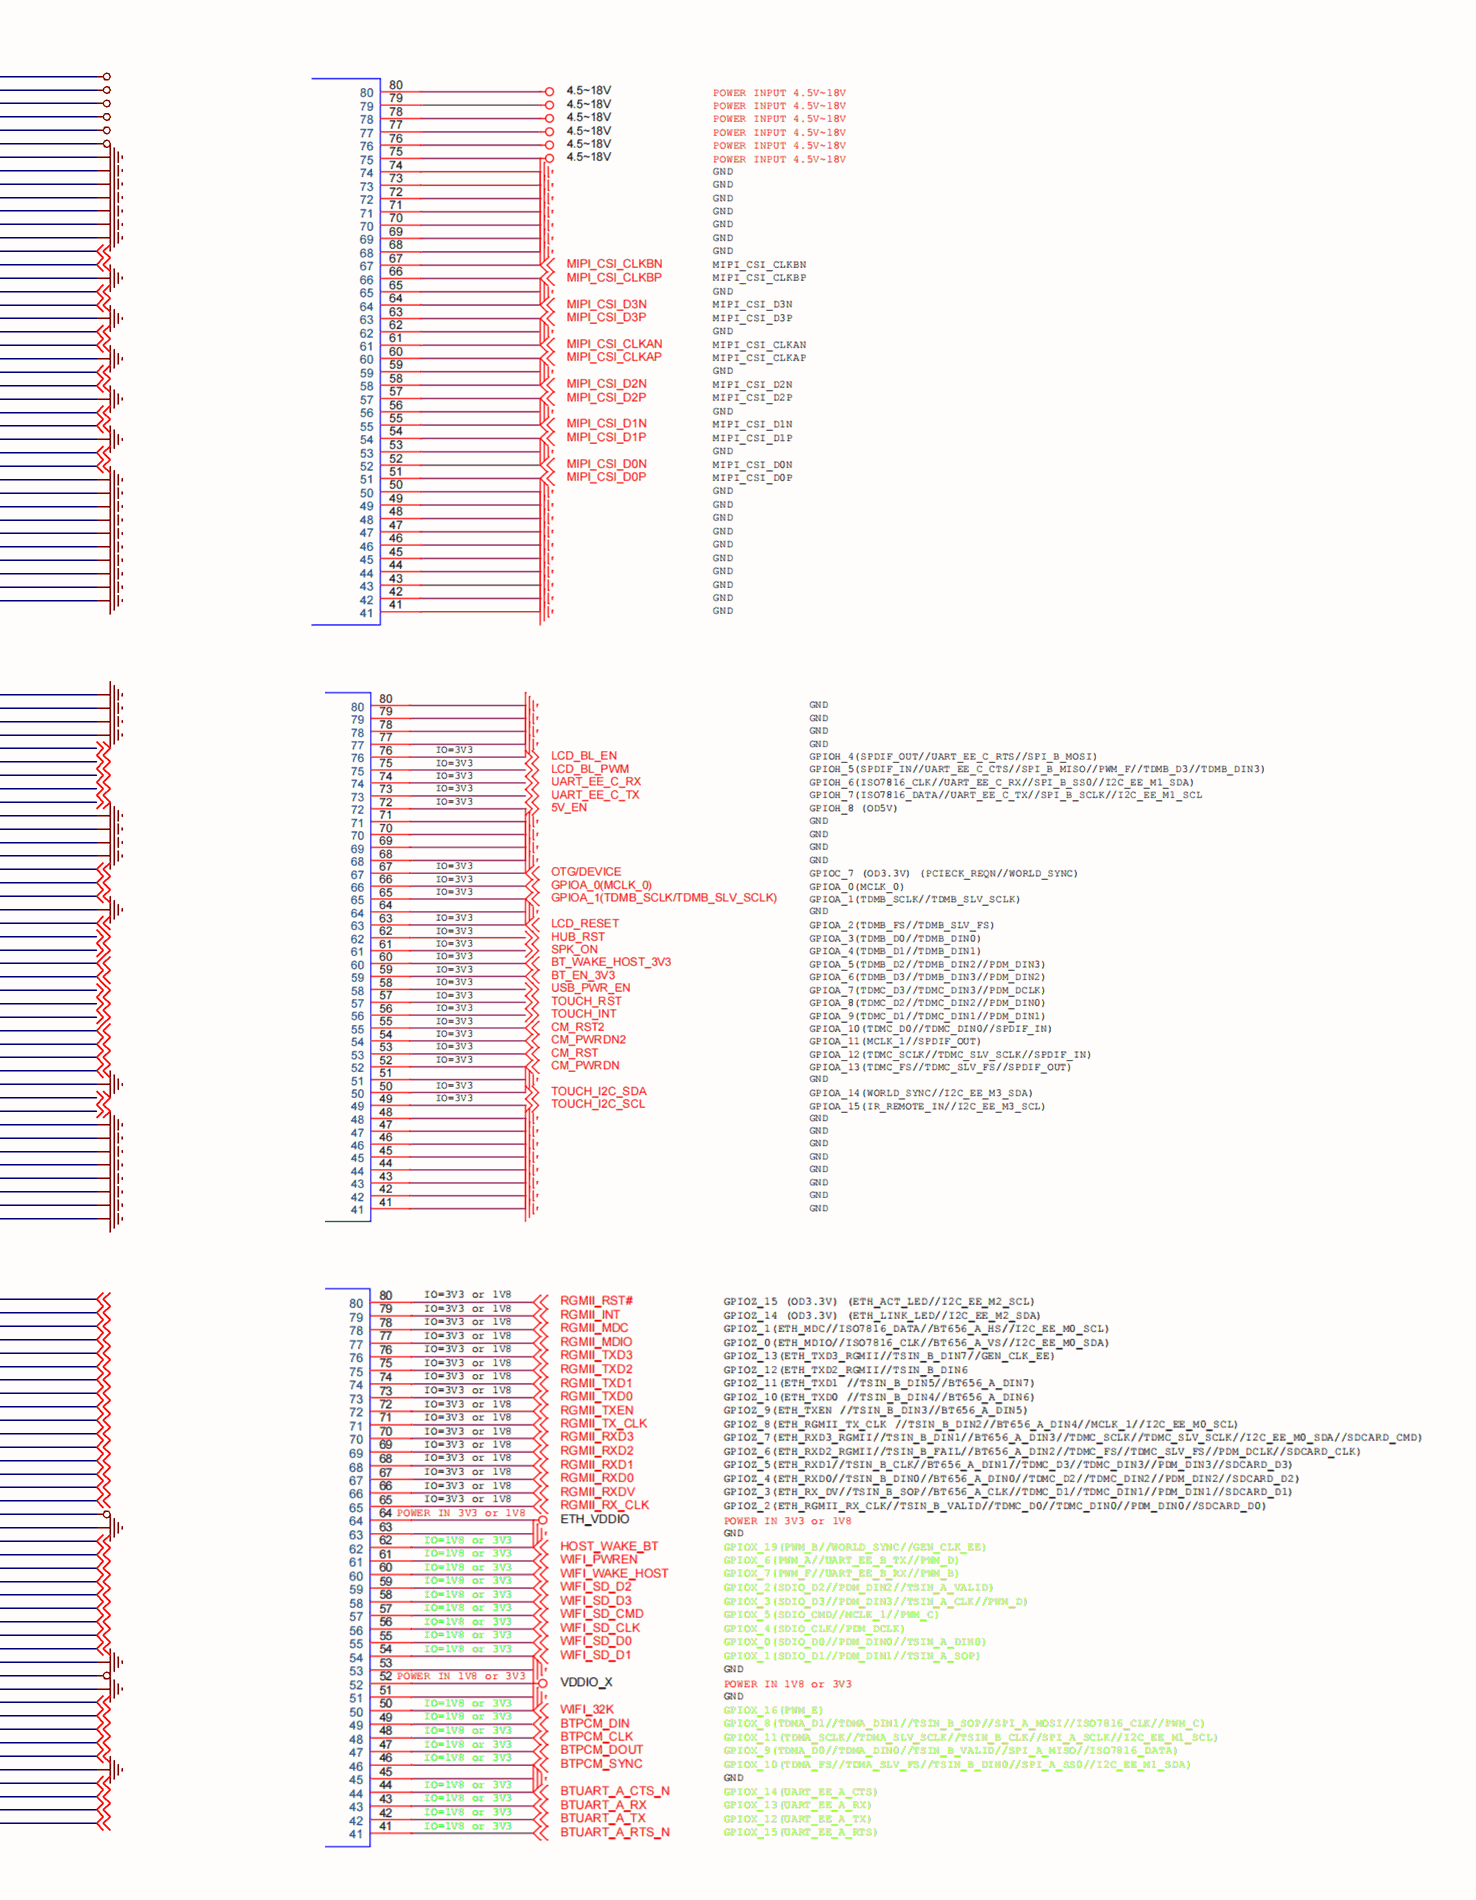
[diagram p7: SOC.SchDoc, right]

### Parts
(Parts that share a designator on the sheet are numbered #1, #2 ... from top to bottom, then left to right.)
J?#1  (no value)
J?#2  (no value)
J?#3  (no value)

### Nets
GND_IN: J?#1.1 J?#1.2 J?#1.3 J?#1.4 J?#1.5 J?#1.6 J?#1.7 J?#1.8 J?#1.9 J?#1.10 J?#1.11 J?#1.12 J?#1.13 J?#1.14 J?#1.15 J?#1.16 J?#1.17 J?#1.18 J?#1.19 J?#1.20 J?#1.21 J?#1.22 J?#1.23 J?#1.24 J?#1.25 J?#1.26 J?#1.27 J?#1.28 J?#1.29 J?#1.30 J?#1.31 J?#1.32 J?#1.33 J?#1.34 J?#1.35 J?#1.36 J?#1.37 J?#1.38 J?#1.39 J?#1.40 J?#1.41 J?#1.42 J?#1.43 J?#1.44 J?#1.45 J?#1.46 J?#1.47 J?#1.48 J?#1.49 J?#1.50 J?#1.51 J?#1.52 J?#1.53 J?#1.54 J?#1.55 J?#1.56 J?#1.57 J?#1.58 J?#1.59 J?#1.60 J?#1.61 J?#1.62 J?#1.63 J?#1.64 J?#1.65 J?#1.66 J?#1.67 J?#1.68 J?#1.69 J?#1.70 J?#1.71 J?#1.72 J?#1.73 J?#1.74 J?#1.75 J?#1.76 J?#1.77 J?#1.78 J?#1.79 J?#1.80 J?#2.1 J?#2.2 J?#2.3 J?#2.4 J?#2.5 J?#2.6 J?#2.7 J?#2.8 J?#2.9 J?#2.10 J?#2.11 J?#2.12 J?#2.13 J?#2.14 J?#2.15 J?#2.16 J?#2.17 J?#2.18 J?#2.19 J?#2.20 J?#2.21 J?#2.22 J?#2.23 J?#2.24 J?#2.25 J?#2.26 J?#2.27 J?#2.28 J?#2.29 J?#2.30 J?#2.31 J?#2.32 J?#2.33 J?#2.34 J?#2.35 J?#2.36 J?#2.37 J?#2.38 J?#2.39 J?#2.40 J?#2.41 J?#2.42 J?#2.43 J?#2.44 J?#2.45 J?#2.46 J?#2.47 J?#2.48 J?#2.49 J?#2.50 J?#2.51 J?#2.52 J?#2.53 J?#2.54 J?#2.55 J?#2.56 J?#2.57 J?#2.58 J?#2.59 J?#2.60 J?#2.61 J?#2.62 J?#2.63 J?#2.64 J?#2.65 J?#2.66 J?#2.67 J?#2.68 J?#2.69 J?#2.70 J?#2.71 J?#2.72 J?#2.73 J?#2.74 J?#2.75 J?#2.76 J?#2.77 J?#2.78 J?#2.79 J?#2.80 J?#3.1 J?#3.2 J?#3.3 J?#3.4 J?#3.5 J?#3.6 J?#3.7 J?#3.8 J?#3.9 J?#3.10 J?#3.11 J?#3.12 J?#3.13 J?#3.14 J?#3.15 J?#3.16 J?#3.17 J?#3.18 J?#3.19 J?#3.20 J?#3.21 J?#3.22 J?#3.23 J?#3.24 J?#3.25 J?#3.26 J?#3.27 J?#3.28 J?#3.29 J?#3.30 J?#3.31 J?#3.32 J?#3.33 J?#3.34 J?#3.35 J?#3.36 J?#3.37 J?#3.38 J?#3.39 J?#3.40 J?#3.41 J?#3.42 J?#3.43 J?#3.44 J?#3.45 J?#3.46 J?#3.47 J?#3.48 J?#3.49 J?#3.50 J?#3.51 J?#3.52 J?#3.53 J?#3.54 J?#3.55 J?#3.56 J?#3.57 J?#3.58 J?#3.59 J?#3.60 J?#3.61 J?#3.62 J?#3.63 J?#3.64 J?#3.65 J?#3.66 J?#3.67 J?#3.68 J?#3.69 J?#3.70 J?#3.71 J?#3.72 J?#3.73 J?#3.74 J?#3.75 J?#3.76 J?#3.77 J?#3.78 J?#3.79 J?#3.80 ; off-sheet 

### Library data of the parts
J?#1-J?#3 = CON40_0

## Sheet POWER.SchDoc
size A2
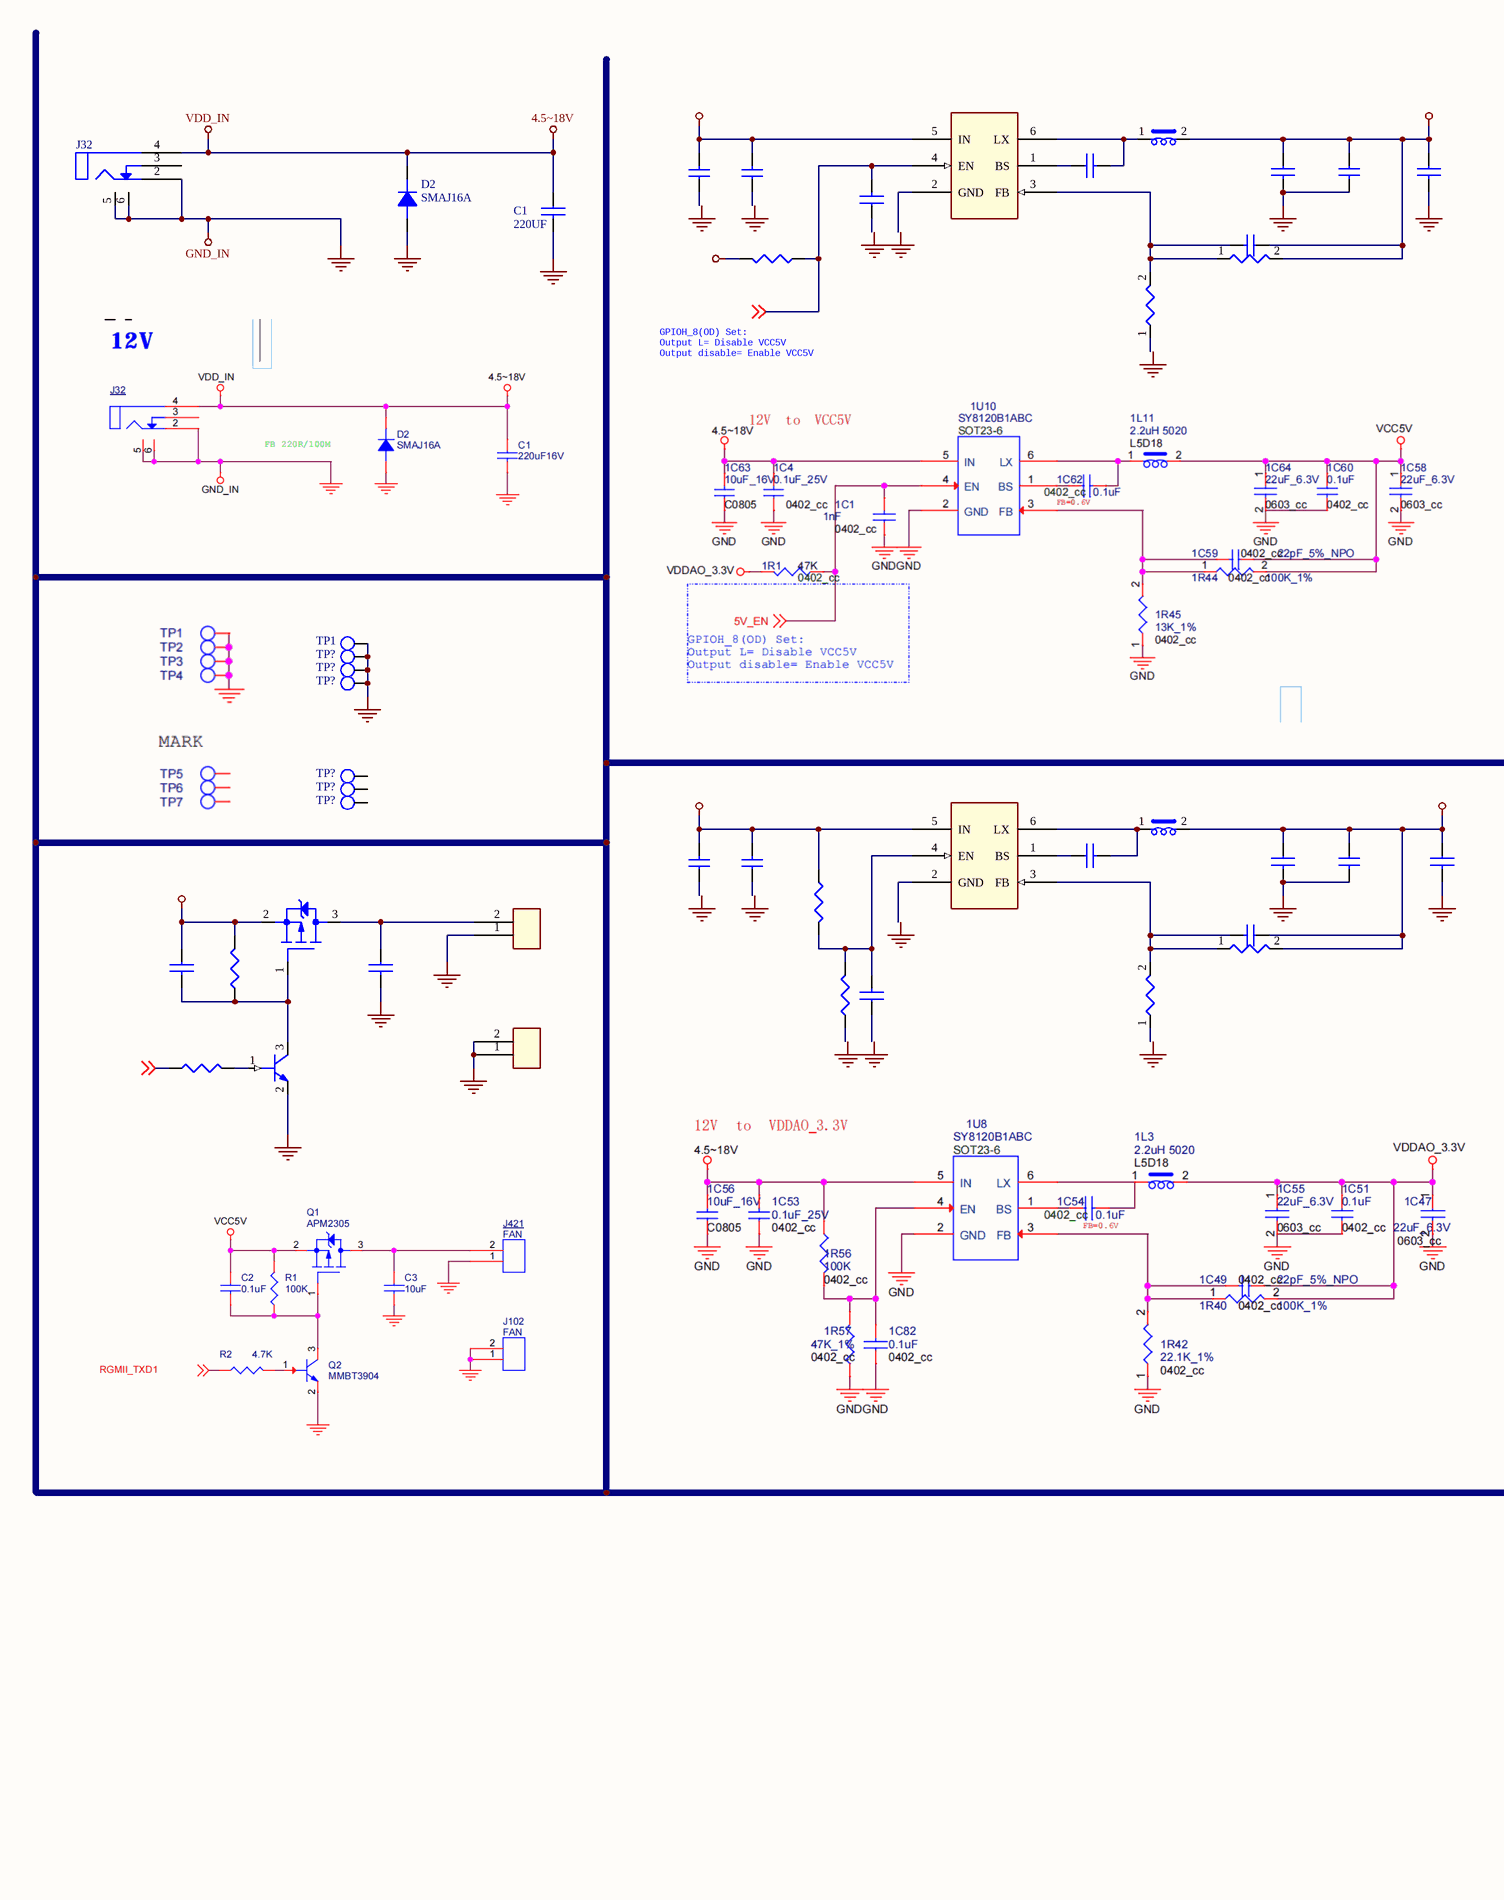
[diagram p8: POWER.SchDoc, left]
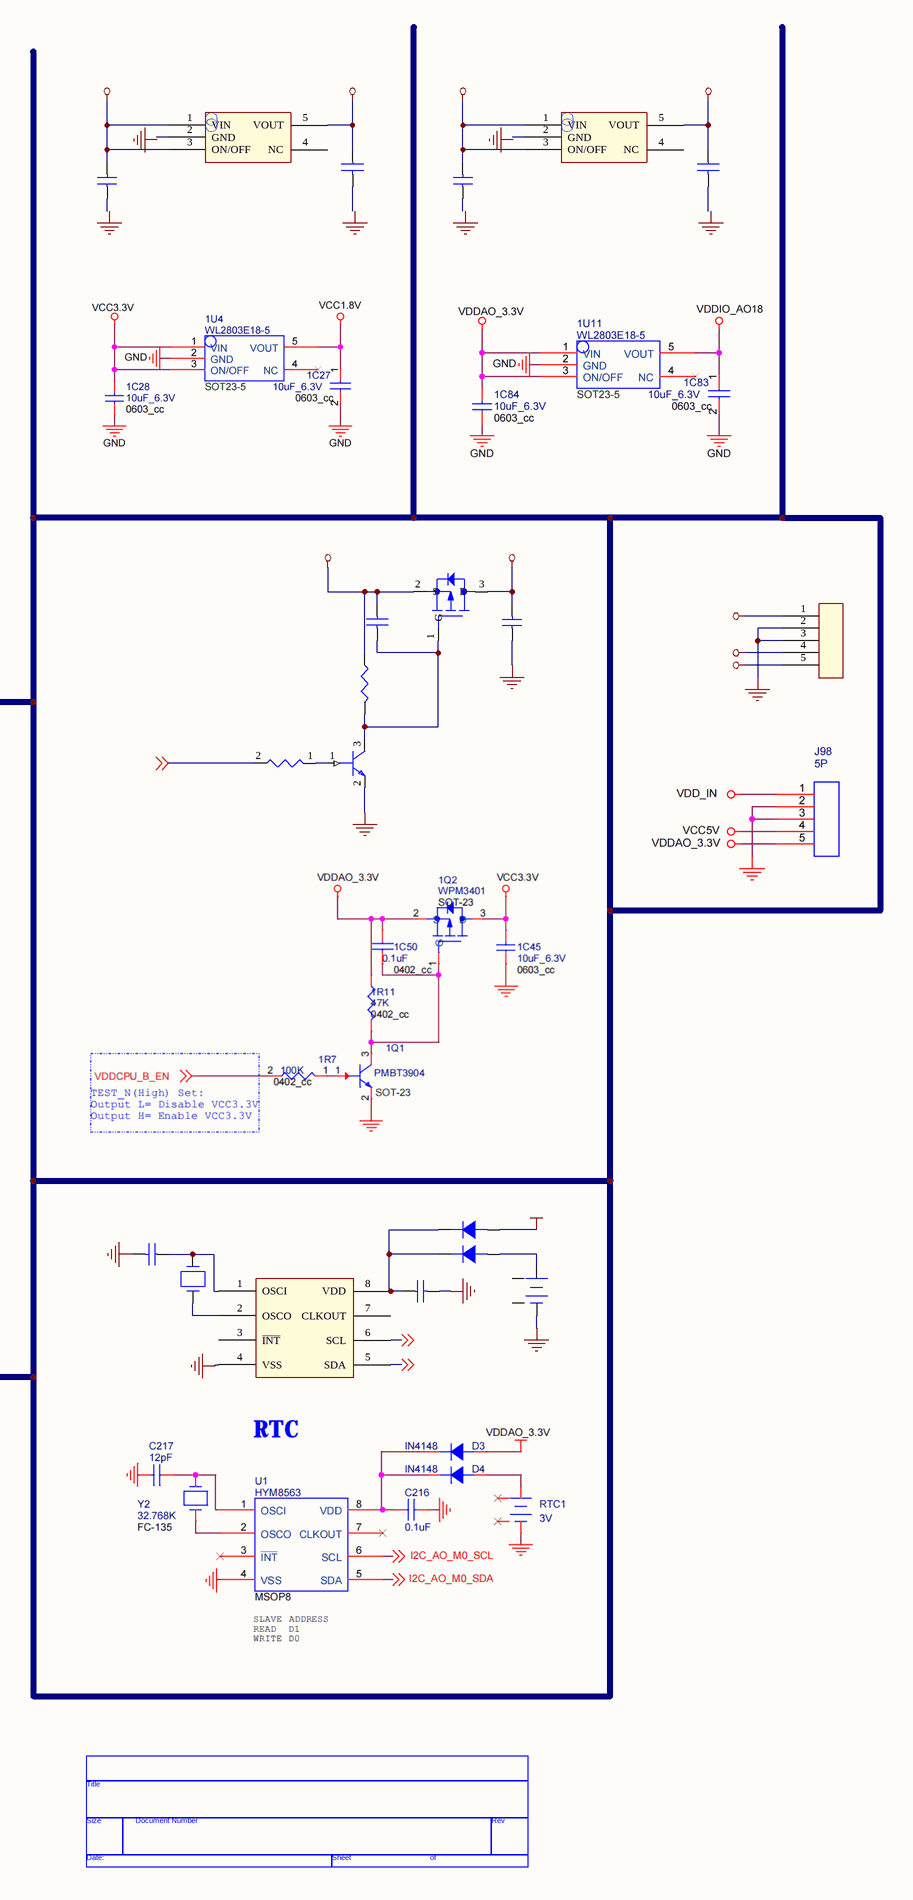
[diagram p9: POWER.SchDoc, right]

### Parts
(Parts that share a designator on the sheet are numbered #1, #2 ... from top to bottom, then left to right.)
*?  TitleBlock0  (value not drawn)  (graphical)
?#1  (no value)  [SOT23-6L]
?#2  (no value)
?#3  (no value)  [SOT-23-5]
?#4  (no value)  [SOT-23-5]
?#5  (no value)
?#6  (no value)  [C0402]
?#7  (no value)  [0603C]
?#8  (no value)  [C0402]
?#9  (no value)  [0603C]
?#10  (no value)  [0603C]
?#11  (no value)  [C0402]
?#12  (no value)  [C0402]
?#13  (no value)  [C0805]
?#14  (no value)  [0603C]
?#15  (no value)  [0603C]
?#16  (no value)  [0603C]
?#17  RTC1  (value not drawn)
?#18  (no value)
?#19  (no value)
?#20  (no value)
?#21  (no value)
?#22  (no value)  [0603C]
?#23  RTC1  [R0603/SMD]  (value not drawn)
?#24  (no value)  [SOT23-6L]
?#25  (no value)
?#26  (no value)
?#27  (no value)
?#28  (no value)
?#29  (no value)  [C0402]
?#30  1C58  [0603C]  (value not drawn)
?#31  (no value)  [C0402]
?#32  (no value)  [0603C]
?#33  (no value)  [0603C]
?#34  (no value)  [R0603/SMD]
?#35  (no value)  [0603C]
?#36  (no value)
?#37  (no value)  [R0603/SMD]
?#38  (no value)
?#39  (no value)
C1  220UF
C?#1  1C58  (value not drawn)
C?#2  (no value)  [C0402]
C?#3  (no value)  [C0402]
C?#4  (no value)  [C0402]
D2  SMAJ16A
D?#1  (no value)
D?#2  (no value)
J32  (no value)
J?#4  (no value)
J?#5  (no value)
J?#6  (no value)
Q?#1  (no value)
Q?#2  (no value)
R?#1  (no value)
R?#2  (no value)
RTC?  (no value)
TP1  (no value)
TP?#1  (no value)
TP?#2  (no value)
TP?#3  (no value)
TP?#4  (no value)
TP?#5  (no value)
TP?#6  (no value)
U?  (no value)
Y?  (no value)

### Nets
4.5~18V: C1.1 D2.2(K) J32.4  [also labelled VDD_IN]
GND_IN: ?#1.4(EN) ?#1.5(IN) ?#2.2 ?#3.1(VIN) ?#3.3(ON/OFF) ?#3.5(VOUT) ?#4.1(VIN) ?#4.3(ON/OFF) ?#4.5(VOUT) ?#6.1 ?#6.2 ?#7.1 ?#7.2 ?#8.1 ?#8.2 ?#9.2 ?#10.2 ?#11.1 ?#12.1 ?#13.2 ?#14.2 ?#15.2 ?#16.1 ?#17.1 ?#17.2 ?#18.2 ?#20.1 ?#21.2(S) ?#21.3(D) ?#22.1 ?#22.2 ?#23.2 ?#24.5(IN) ?#25.2 ?#26.2(EMITTER) ?#28.2 ?#29.1 ?#29.2 ?#30.1 ?#30.2 ?#31.1 ?#31.2 ?#32.2 ?#33.2 ?#34.2 ?#35.1 ?#36.2 C1.2 C?#1.1 C?#2.2 C?#3.2 C?#4.2 D2.1(A) D?#1.1(A) J32.2 J32.5 J32.6 J?#4.1 J?#4.2 J?#4.3 J?#4.4 J?#4.5 J?#5.1 J?#6.1 J?#6.2 Q?#1.2(S) Q?#2.2(EMITTER) R?#1.2 R?#2.1 RTC?.2(-) TP1.1(TP) TP?#1.1(TP) TP?#2.1(TP) TP?#3.1(TP) U?.4(VSS) U?.5(SDA) U?.6(SCL) ; off-sheet 
Net?#1_1: ?#1.1(BS) ?#5.1
Net?#1_3: ?#1.3(FB) ?#16.2 ?#18.1 ?#19.2
Net?#1_6: ?#1.6(LX) ?#2.1 ?#5.2
Net?#20_2: ?#20.2 ?#21.1(G) ?#23.1 ?#26.3(COLLECTOR)
Net?#24_1: ?#24.1(BS) ?#27.1
Net?#24_3: ?#24.3(FB) ?#35.2 ?#36.1 ?#39.2
Net?#24_4: ?#24.4(EN) ?#34.1 ?#37.1 ?#38.2
Net?#24_6: ?#24.6(LX) ?#25.1 ?#27.2
Net?#26_1: ?#26.1(BASE) ?#28.1
NetC?#1_2: C?#1.2 Q?#1.1(G) Q?#2.3(COLLECT) R?#1.1
NetC?#2_1: C?#2.1 J?#5.2 Q?#1.3(D)
NetC?#3_1: C?#3.1 U?.1(OSCI) Y?.1
NetC?#4_1: C?#4.1 D?#1.2(K) D?#2.2(K) U?.8(VDD)
NetD?#2_1: D?#2.1(A) RTC?.1(+)
NetQ?#2_1: Q?#2.1(BASE) R?#2.2
NetU?_2: U?.2(OSCO) Y?.2

Not connected (* = marked no-connect by the designer): ?#1 2(GND); ?#3 2(GND) 4(NC); ?#4 2(GND) 4(NC); ?#9 1; ?#10 1; ?#11 2; ?#12 2; ?#13 1; ?#14 1; ?#15 1; ?#19 1; ?#24 2(GND); ?#32 1; ?#33 1; ?#37 2; ?#38 1; ?#39 1; J32 3; RTC? 3 4; TP?#4 1(TP); TP?#5 1(TP); TP?#6 1(TP); U? 3(~{INT}) 7(CLKOUT)

### Notes on the sheet
- GPIOH_8(OD) Set:
  Output L= Disable VCC5V
  Output disable= Enable VCC5V
- (in symbol TitleBlock0) Title; Size; Document Number; Rev; Date:; Sheet; of

### Library data of the parts
?#1 ?#24 = SY81XX
?#2 = Indu
?#3 ?#4 = WL2003E
?#5 ?#27 C?#1 = CAP NP_9
?#6 ?#8 ?#11 ?#12 ?#29 ?#31 C?#2-C?#4 = CAP NP
?#7 ?#9 ?#10 ?#14-?#16 ?#22 ?#30 ?#32 ?#33 ?#35 = capnp
?#13 = C0805
?#17 = RESISTOR
?#18 ?#19 ?#28 ?#36 ?#39 = RES-V
?#20 ?#38 = CAP NP_7
?#21 = P-MOSFET
?#23 ?#34 ?#37 = R0603_0
?#25 = In
?#26 = npn
C1 = CAP
D2 D?#1 D?#2 = DIODE
J32 = CONN JACK PWR_0
J?#4 = CON4_1
J?#5 J?#6 = CON2
Q?#1 = APM2301
Q?#2 = NPN_1
R?#1 = RESISTOR_0
R?#2 = R
RTC? = BATTERY_5
TP1 TP?#1-TP?#6 = T POINT R
U? = RTC
Y? = CRYSTAL-4P_1

## Nets that join several sheets
4.5~18V: mipi_dsi (J5.1), POWER (C1.1 D2.2 J32.4)
GND: hdmi (24 pins), usb (12 pins), tfcard (20 pins)
GND_IN: wifi (22 pins), usb (43 pins), mipi_dsi (12 pins), tfcard (65.1 J107.6 J108.6), SOC (240 pins), POWER (77 pins)
VCC5V: hdmi (9Q2.1 9R8.2), usb (9 pins), mipi_dsi (J5.3)
VDDAO_3.3V: wifi (R92.2), hdmi (9Q2.2 9R11.1 9R11.2 9R17.1), tfcard (6C1.2 6J4.4 6R4.1 6R25.1)
VDDIO_AO18: wifi (R90.2), tfcard (2R4.2 S?#1.2)